# Altium project Using Signal Harnesses - Brendan Cook.PrjPCB
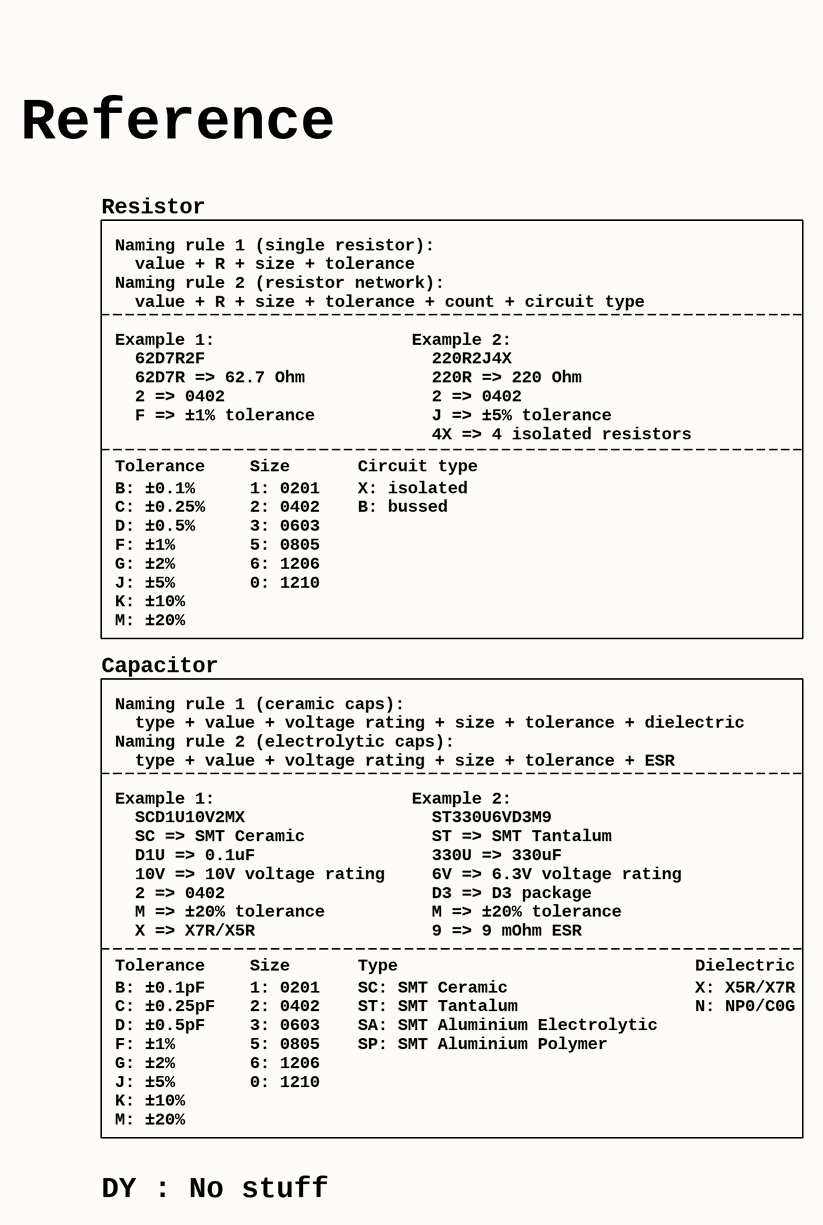
[diagram p0:  1_reference.SchDoc]
 Project: KAME_FMU;  ProjectRev: 2
9 sheets, 102 parts. Net scope: hierarchical (ports join the sheet entries above them; power ports are global).
Board file:  Kame_FMU.PcbDoc
Sheets:
   1_reference.SchDoc
   2_mb_conn.SchDoc
   3_power.SchDoc
   4_cpu.SchDoc
   5_spi_memory.SchDoc
   6_uart_esc_i2c.SchDoc
   7_can_rc_i2c_analog.SchDoc
   8_imu_debug_conn.SchDoc
   0_TOP_Sheet.SchDoc

## Sheet  1_reference.SchDoc: Reference
size A3; CompanyName: Altium; Organization: Altium Training Team; Address1: Canada/Germany; Address2: UK / USA and Partner; Address3: Adv Training; Address4: (c) Altium; SheetNumber: 1; SheetTotal: 9

### Notes on the sheet
- Reference
- Resistor
- Naming rule 1 (single resistor):
  value + R + size + tolerance
  Naming rule 2 (resistor network):
  value + R + size + tolerance + count + circuit type
- Example 1:
  62D7R2F
  62D7R => 62.7 Ohm
  2 => 0402
  F => ±1% tolerance
- Tolerance
- Size
- Circuit type
- Example 2:
  220R2J4X
  220R => 220 Ohm
  2 => 0402
  J => ±5% tolerance
  4X => 4 isolated resistors
- B: ±0.1%
  C: ±0.25%
  D: ±0.5%
  F: ±1%
  G: ±2%
  J: ±5%
  K: ±10%
  M: ±20%
- 1: 0201
  2: 0402
  3: 0603
  5: 0805
  6: 1206
  0: 1210
- X: isolated
  B: bussed
- Capacitor
- Naming rule 1 (ceramic caps):
  type + value + voltage rating + size + tolerance + dielectric
  Naming rule 2 (electrolytic caps):
  type + value + voltage rating + size + tolerance + ESR
- Example 1:
  SCD1U10V2MX
  SC => SMT Ceramic
  D1U => 0.1uF
  10V => 10V voltage rating
  2 => 0402
  M => ±20% tolerance
  X => X7R/X5R
- Example 2:
  ST330U6VD3M9
  ST => SMT Tantalum
  330U => 330uF
  6V => 6.3V voltage rating
  D3 => D3 package
  M => ±20% tolerance
  9 => 9 mOhm ESR
- Type
- Dielectric
- B: ±0.1pF
  C: ±0.25pF
  D: ±0.5pF
  F: ±1%
  G: ±2%
  J: ±5%
  K: ±10%
  M: ±20%
- SC: SMT Ceramic
  ST: SMT Tantalum
  SA: SMT Aluminium Electrolytic
  SP: SMT Aluminium Polymer
- X: X5R/X7R
  N: NP0/C0G
- DY : No stuff
- Title
- Size:
- Date:
- A3
- Number:
- Time:
- Revision:
- Sheet
- of
- File:

## Sheet  2_mb_conn.SchDoc: Motherboard connectors
size A3; CompanyName: Altium; Organization: Altium Training Team; Address1: Canada/Germany; Address2: UK / USA and Partner; Address3: Adv Training; Address4: (c) Altium; SheetNumber: 2; SheetTotal: 9
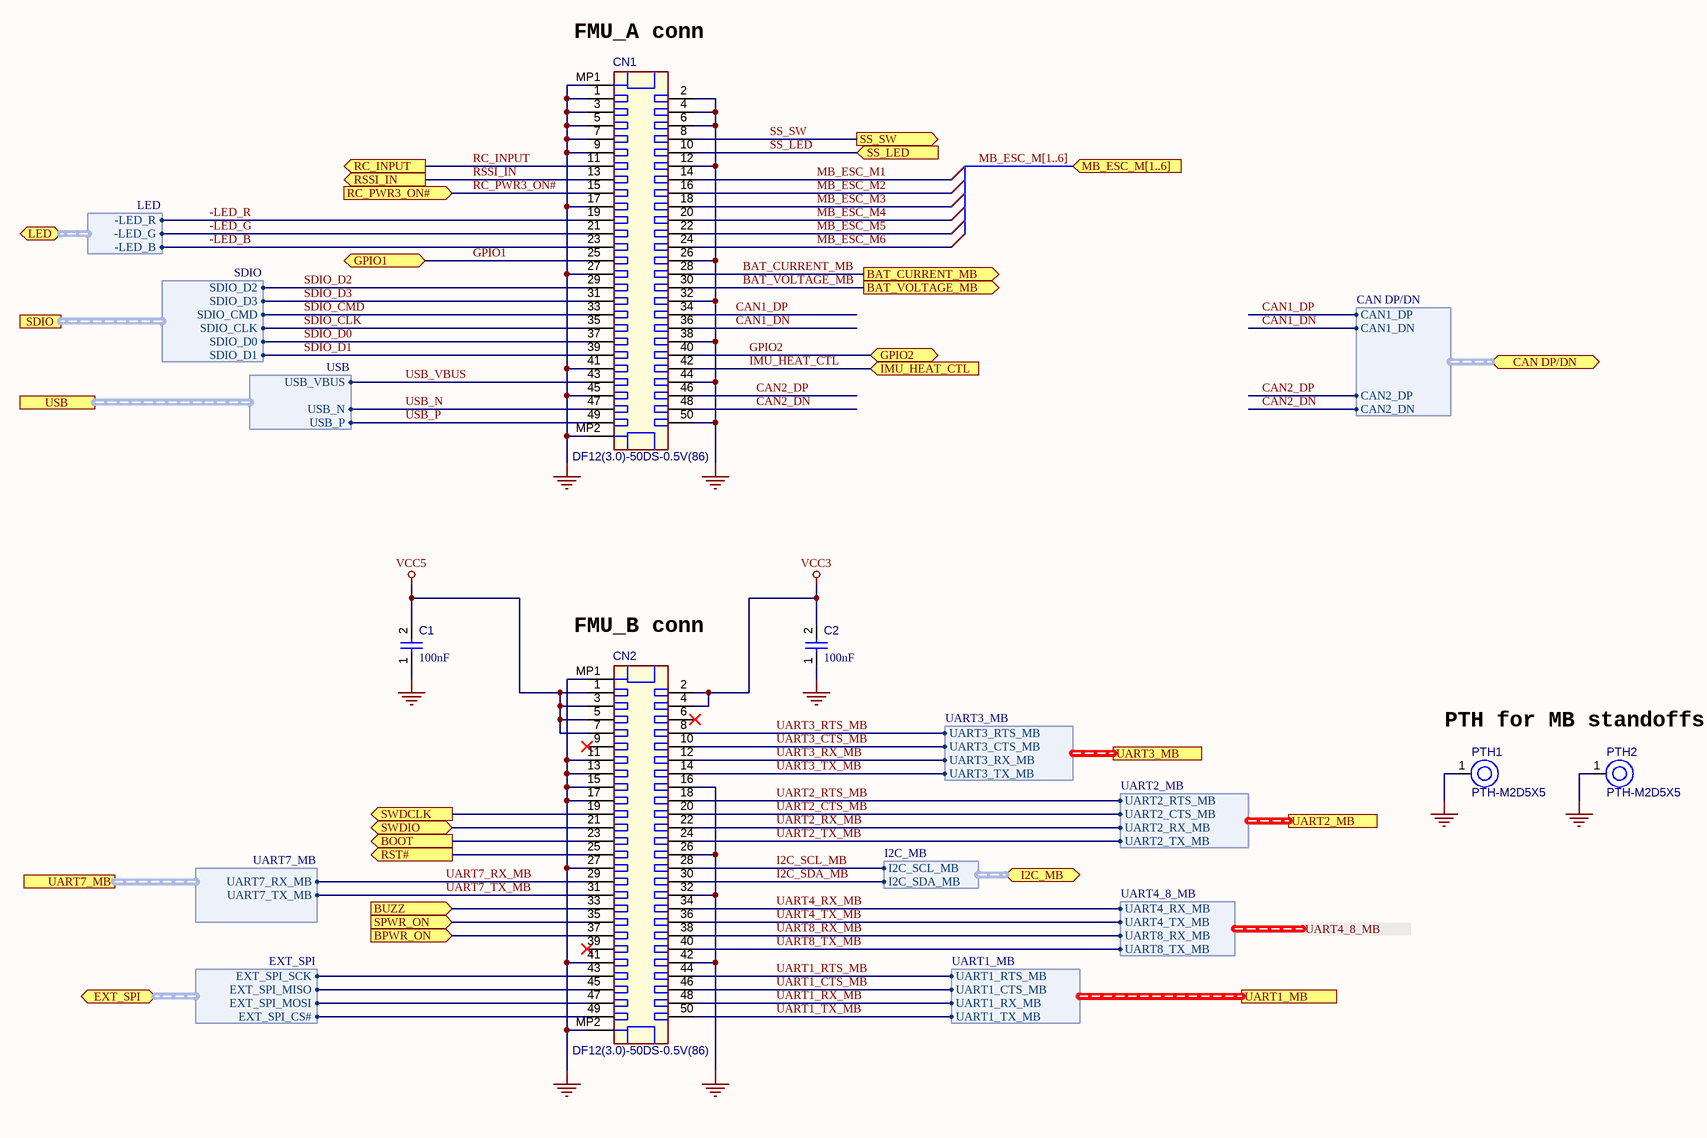
[diagram p1:  2_mb_conn.SchDoc]

### Parts
C1  value 100nF  [CAPC0402(1005)60_L]  (hidden comment: Capacitor 100nF +/-20% 10V 0402)
C2  value 100nF  [CAPC0402(1005)60_L]  (hidden comment: Capacitor 100nF +/-20% 10V 0402)
CN1  DF12(3.0)-50DS-0.5V(86)  [HIRO-DF12(3.0)-50DS-0.5V_V]
CN2  DF12(3.0)-50DS-0.5V(86)  [HIRO-DF12(3.0)-50DS-0.5V_V]
PTH1  PTH-M2D5X5  [PTH-M2D5X5]
PTH2  PTH-M2D5X5  [PTH-M2D5X5]

### Ports
BAT_CURRENT_MB (out), BAT_VOLTAGE_MB (out), BOOT (out), BPWR_ON (in), BUZZ (in), CAN DP/DN (bidir, harness CAN DP/DN), EXT_SPI (bidir, harness EXT_SPI), GPIO1 (bidir), GPIO2 (bidir), I2C_MB (bidir, harness I2C_MB), IMU_HEAT_CTL (in), LED (bidir, harness LED), MB_ESC_M[1..6] (in), RC_INPUT (out), RC_PWR3_ON# (in), RSSI_IN (out), RST# (out), SDIO (harness SDIO), SPWR_ON (in), SS_LED (in), SS_SW (out), SWDCLK (out), SWDIO (bidir), UART1_MB (harness UART1_MB), UART2_MB (harness UART2_MB), UART3_MB (harness UART3_MB), UART4_8_MB (harness UART4_8_MB), UART7_MB (harness UART7_MB), USB (harness USB)

### Harnesses
SDIO: SDIO_D2, SDIO_D3, SDIO_CMD, SDIO_CLK, SDIO_D0, SDIO_D1
USB: USB_VBUS, USB_N, USB_P
LED: -LED_R, -LED_G, -LED_B
CAN DP/DN: CAN1_DP, CAN1_DN, CAN2_DP, CAN2_DN
UART3_MB: UART3_RTS_MB, UART3_CTS_MB, UART3_RX_MB, UART3_TX_MB
UART2_MB: UART2_RTS_MB, UART2_CTS_MB, UART2_RX_MB, UART2_TX_MB
UART1_MB: UART1_RTS_MB, UART1_CTS_MB, UART1_RX_MB, UART1_TX_MB
I2C_MB: I2C_SCL_MB, I2C_SDA_MB
EXT_SPI: EXT_SPI_SCK, EXT_SPI_MISO, EXT_SPI_MOSI, EXT_SPI_CS#
UART4_8_MB: UART4_RX_MB, UART4_TX_MB, UART8_RX_MB, UART8_TX_MB
UART7_MB: UART7_RX_MB, UART7_TX_MB

### Nets
GND: C1.1 C2.1 CN1.1 CN1.2 CN1.3 CN1.4 CN1.5 CN1.6 CN1.7 CN1.9 CN1.12 CN1.17 CN1.26 CN1.27 CN1.32 CN1.38 CN1.41 CN1.44 CN1.45 CN1.50 CN1.MP1 CN1.MP2 CN2.11 CN2.13 CN2.15 CN2.16 CN2.17 CN2.26 CN2.27 CN2.32 CN2.41 CN2.42 CN2.MP1 CN2.MP2 PTH1.1(H1) PTH2.1(H1)
VCC3: C2.2 CN2.2 CN2.4
VCC5: C1.2 CN2.1 CN2.3 CN2.5 CN2.7
-LED_B: CN1.23 ; port LED.-LED_B
-LED_G: CN1.21 ; port LED.-LED_G
-LED_R: CN1.19 ; port LED.-LED_R
BAT_CURRENT_MB: CN1.28 ; port BAT_CURRENT_MB
BAT_VOLTAGE_MB: CN1.30 ; port BAT_VOLTAGE_MB
CAN1_DN: CN1.36 ; port CAN DP/DN.CAN1_DN
CAN1_DP: CN1.34 ; port CAN DP/DN.CAN1_DP
CAN2_DN: CN1.48 ; port CAN DP/DN.CAN2_DN
CAN2_DP: CN1.46 ; port CAN DP/DN.CAN2_DP
GPIO1: CN1.25 ; port GPIO1
GPIO2: CN1.40 ; port GPIO2
I2C_SCL_MB: CN2.28 ; port I2C_MB.I2C_SCL_MB
I2C_SDA_MB: CN2.30 ; port I2C_MB.I2C_SDA_MB
IMU_HEAT_CTL: CN1.42 ; port IMU_HEAT_CTL
MB_ESC_M1: CN1.14
MB_ESC_M2: CN1.16
MB_ESC_M3: CN1.18
MB_ESC_M4: CN1.20
MB_ESC_M5: CN1.22
MB_ESC_M6: CN1.24
RC_INPUT: CN1.11 ; port RC_INPUT
RC_PWR3_ON#: CN1.15 ; port RC_PWR3_ON#
RSSI_IN: CN1.13 ; port RSSI_IN
SDIO_CLK: CN1.35 ; port SDIO.SDIO_CLK
SDIO_CMD: CN1.33 ; port SDIO.SDIO_CMD
SDIO_D0: CN1.37 ; port SDIO.SDIO_D0
SDIO_D1: CN1.39 ; port SDIO.SDIO_D1
SDIO_D2: CN1.29 ; port SDIO.SDIO_D2
SDIO_D3: CN1.31 ; port SDIO.SDIO_D3
SS_LED: CN1.10 ; port SS_LED
SS_SW: CN1.8 ; port SS_SW
UART1_CTS_MB: CN2.46 ; port UART1_MB.UART1_CTS_MB
UART1_RTS_MB: CN2.44 ; port UART1_MB.UART1_RTS_MB
UART1_RX_MB: CN2.48 ; port UART1_MB.UART1_RX_MB
UART1_TX_MB: CN2.50 ; port UART1_MB.UART1_TX_MB
UART2_CTS_MB: CN2.20 ; port UART2_MB.UART2_CTS_MB
UART2_RTS_MB: CN2.18 ; port UART2_MB.UART2_RTS_MB
UART2_RX_MB: CN2.22 ; port UART2_MB.UART2_RX_MB
UART2_TX_MB: CN2.24 ; port UART2_MB.UART2_TX_MB
UART3_CTS_MB: CN2.10 ; port UART3_MB.UART3_CTS_MB
UART3_RTS_MB: CN2.8 ; port UART3_MB.UART3_RTS_MB
UART3_RX_MB: CN2.12 ; port UART3_MB.UART3_RX_MB
UART3_TX_MB: CN2.14 ; port UART3_MB.UART3_TX_MB
UART4_RX_MB: CN2.34 ; port UART4_8_MB.UART4_RX_MB
UART4_TX_MB: CN2.36 ; port UART4_8_MB.UART4_TX_MB
UART7_RX_MB: CN2.29 ; port UART7_MB.UART7_RX_MB
UART7_TX_MB: CN2.31 ; port UART7_MB.UART7_TX_MB
UART8_RX_MB: CN2.38 ; port UART4_8_MB.UART8_RX_MB
UART8_TX_MB: CN2.40 ; port UART4_8_MB.UART8_TX_MB
USB_N: CN1.47 ; port USB.USB_N
USB_P: CN1.49 ; port USB.USB_P
USB_VBUS: CN1.43 ; port USB.USB_VBUS
NetCN2_19: CN2.19 ; port SWDCLK
NetCN2_21: CN2.21 ; port SWDIO
NetCN2_23: CN2.23 ; port BOOT
NetCN2_25: CN2.25 ; port RST#
NetCN2_33: CN2.33 ; port BUZZ
NetCN2_35: CN2.35 ; port SPWR_ON
NetCN2_37: CN2.37 ; port BPWR_ON
NetCN2_43: CN2.43 ; port EXT_SPI.EXT_SPI_SCK
NetCN2_45: CN2.45 ; port EXT_SPI.EXT_SPI_MISO
NetCN2_47: CN2.47 ; port EXT_SPI.EXT_SPI_MOSI
NetCN2_49: CN2.49 ; port EXT_SPI.EXT_SPI_CS#

Not connected (* = marked no-connect by the designer): CN2 6* 9* 39*

### Buses and harness runs
bus MB_ESC_M[1..6] = port MB_ESC_M[1..6]

### Notes on the sheet
- (near CN1) FMU_A conn
- (near CN2) FMU_B conn
- PTH for MB standoffs
- Title
- Size:
- Date:
- A3
- Number:
- Time:
- Revision:
- Sheet
- of
- File:

### Library data of the parts
C1 C2 = CMP-001-00061-2: Chip Capacitor, 100nF +/-20%, 10V, 0402, Thickness 0.6 mm; Tolerance: 20%; Voltage Rating: 10V; Mounting Technology: SMT; Min Operating Temperature: -55°C; Pins: 2; Case/Package: 0402; Max Operating Temperature: 85°C
CN1 CN2 = CMP-002-00058-3: Receptacle Connector, 50 V, 0.3 A, -45 to 125 degC, RoHS, Tape and Reel; Pins: 52
PTH1 PTH2 = CMP-00028-00004-1: M2 PTH (2.5mm), 5mm pad; Pins: 1

## Sheet  3_power.SchDoc
size A4; CompanyName: Altium; Organization: Altium Training Team; Address1: Canada/Germany; Address2: UK / USA and Partner; Address3: Adv Training; Address4: (c) Altium; SheetNumber: 3; SheetTotal: 9
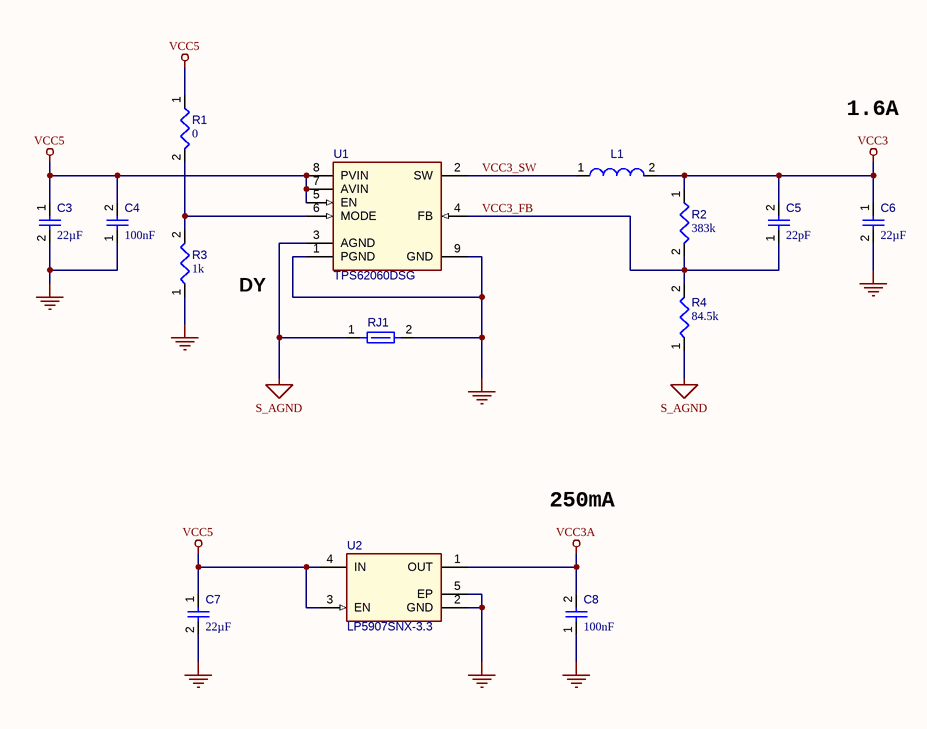
[diagram p2:  3_power.SchDoc]

### Parts
C3  value 22µF  [CAPC0805(2012)145_L]  (hidden comment: Capacitor 22µF +/-40% 16V 0805)
C4  value 100nF  [CAPC0402(1005)60_L]  (hidden comment: Capacitor 100nF +/-20% 10V 0402)
C5  value 22pF  [CAPC0402(1005)60_L]  (hidden comment: Capacitor 22pF +/-10% 50V 0402)
C6  value 22µF  [CAPC0805(2012)145_L]  (hidden comment: Capacitor 22µF +/-40% 16V 0805)
C7  value 22µF  [CAPC0805(2012)145_L]  (hidden comment: Capacitor 22µF +/-40% 16V 0805)
C8  value 100nF  [CAPC0402(1005)60_L]  (hidden comment: Capacitor 100nF +/-20% 10V 0402)
L1  VLS252010HBX-2R2M-1  [TDK-VLS252010_V]  (value not drawn)
R1  value 0  [RESC0402(1005)_L]  (hidden comment: Jumper 0402)
R2  value 383k  [RESC0402(1005)_L]  (hidden comment: Resistor 383K +/-1 % 0402 63 mW)
R3  value 1k  [RESC0402(1005)_L]  (hidden comment: Resistor 1K +/-5 % 0402 63 mW)
R4  value 84.5k  [RESC0402(1005)_L]  (hidden comment: Resistor 84K5 +/-1 % 0402 63 mW)
RJ1  Net Tie 10x8mil  [New footprint 1]  (value not drawn)  (net tie, no BOM)
U1  TPS62060DSG  [DSG0008A_V]
U2  LP5907SNX-3.3  [TI-DQN4-480X480TP_V]

### Nets
GND: C3.2 C4.1 C6.2 C7.2 C8.1 R3.1 RJ1.2 U1.1(PGND) U1.9(GND) U2.2(GND) U2.5(EP)
S_AGND: R4.1 RJ1.1 U1.3(AGND)
VCC3: C5.2 C6.1 L1.2 R2.1
VCC3A: C8.2 U2.1(OUT)
VCC5: C3.1 C4.2 C7.1 R1.1 U1.5(EN) U1.7(AVIN) U1.8(PVIN) U2.3(EN) U2.4(IN)
VCC3_FB: C5.1 R2.2 R4.2 U1.4(FB)
VCC3_SW: L1.1 U1.2(SW)
NetR1_2: R1.2 R3.2 U1.6(MODE)

### Notes on the sheet
- 1.6A
- DY
- 250mA
- Title
- Size:
- Date:
- A4
- Number:
- Time:
- Revision:
- Sheet
- of
- File:

### Library data of the parts
C3 C6 C7 = CMP-001-00081-3: Chip Capacitor, 22µF +/-40%, 16V, 0805, Thickness 1.45 mm; Tolerance: 5%; Voltage Rating: 16V; Case/Package: 0805; Pins: 2; Mounting Technology: SMT; Max Operating Temperature: 85°C; Min Operating Temperature: -55°C
C4 C8 = CMP-001-00061-2: as C1 on sheet  2_mb_conn; Case/Package: 0402; Min Operating Temperature: -55°C; Mounting Technology: SMT; Max Operating Temperature: 85°C; Pins: 2; Voltage Rating: 10V
C5 = CMP-001-00073-2: Chip Capacitor, 22pF +/-10%, 50V, 0402, Thickness 0.6 mm; Tolerance: 10%; Mounting Technology: SMT; Pins: 2; Voltage Rating: 50V; Case/Package: 0402; Max Operating Temperature: 85°C; Min Operating Temperature: -55°C
L1 = CMP-006-00020-3: Inductor for Power Circuit, 2.2 uH, +/- 20%, -40 to 105 degC, 2-Pin SMD, RoHS, Tape and Reel; Value: 2.2µH; Tolerance: 20%; Mounting Technology: SurfaceMount; Pins: 2
R1 = CMP-009-00148-2: Case/Package: 0402; Max Operating Temperature: 155°C; Min Operating Temperature: -55°C; Pins: 2
R2 = CMP-009-00126-2: Chip Resistor, 383 kOhms, +/-1 %, 63 mW, -55 to 155 degC, 0402; Tolerance: 1%; Power: 63mW; Case/Package: 0402; Max Operating Temperature: 155°C; Min Operating Temperature: -55°C; Pins: 2
R3 = CMP-009-00157-2: Chip Resistor, 1 kOhms, +/-5 %, 63 mW, -55 to 155 degC, 0402; Tolerance: 5%; Power: 63mW; Case/Package: 0402; Max Operating Temperature: 155°C; Min Operating Temperature: -55°C; Pins: 2
R4 = CMP-009-00130-2: Chip Resistor, 84,5 kOhms, +/-1 %, 63 mW, -55 to 155 degC, 0402; Tolerance: 1%; Power: 63mW; Case/Package: 0402; Max Operating Temperature: 155°C; Min Operating Temperature: -55°C; Pins: 2
RJ1 = CMP-009-00116-1: Pins: 2; Max Operating Temperature: 155°C; Min Operating Temperature: -55°C
U1 = CMP-019-00038-2: Step Down Converter, 3 MHz, 1.6 A, -45 to 85 degC, 8-Pin WSON, RoHS, Tape and Reel; Pins: 9
U2 = CMP-019-00040-2: Ultra-Low-Noise, Low-IQ LDO, 3.3 V, 0.25 A, -40 to 125 degC, 4-Pin X2SON, RoHS, Tape and Reel; Output Voltage: 3.3V; Min Operating Temperature: -40°C; Pins: 5; Max Operating Temperature: 125°C

## Sheet  4_cpu.SchDoc: CPU (STM32F427VIT6)
size A2; CompanyName: Altium; Organization: Altium Training Team; Address1: Canada/Germany; Address2: UK / USA and Partner; Address3: Adv Training; Address4: (c) Altium; SheetNumber: 4; SheetTotal: 9
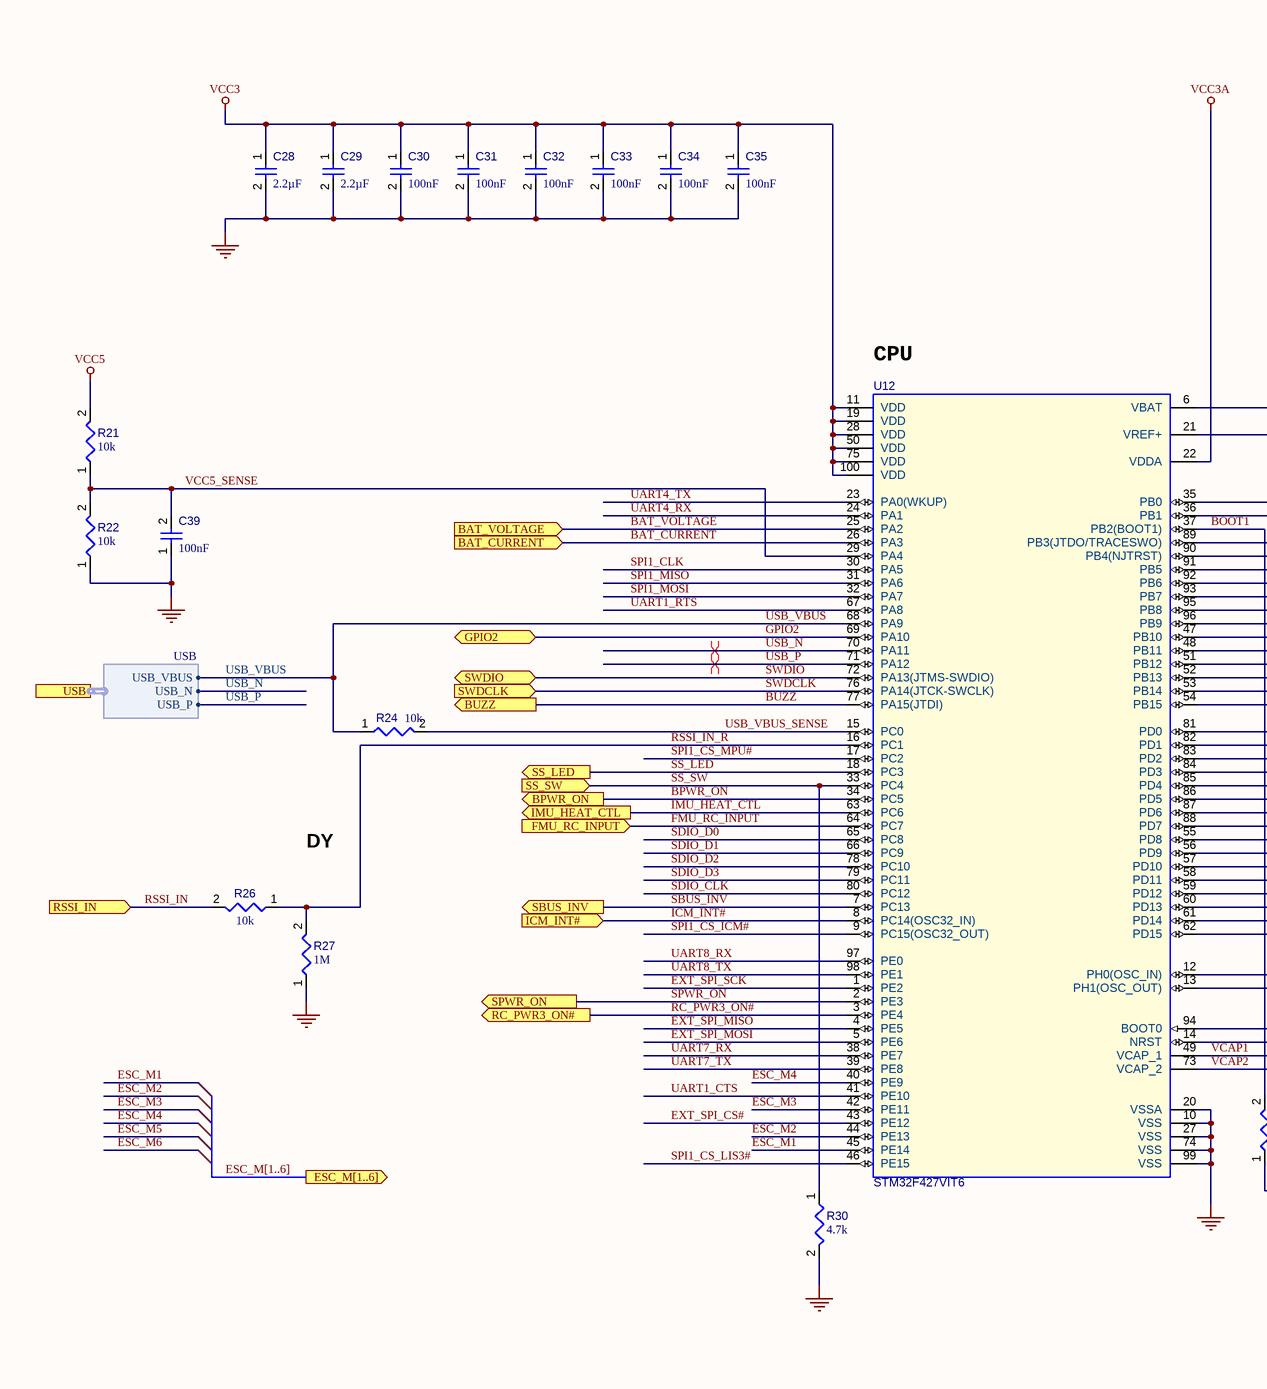
[diagram p3:  4_cpu.SchDoc, left]
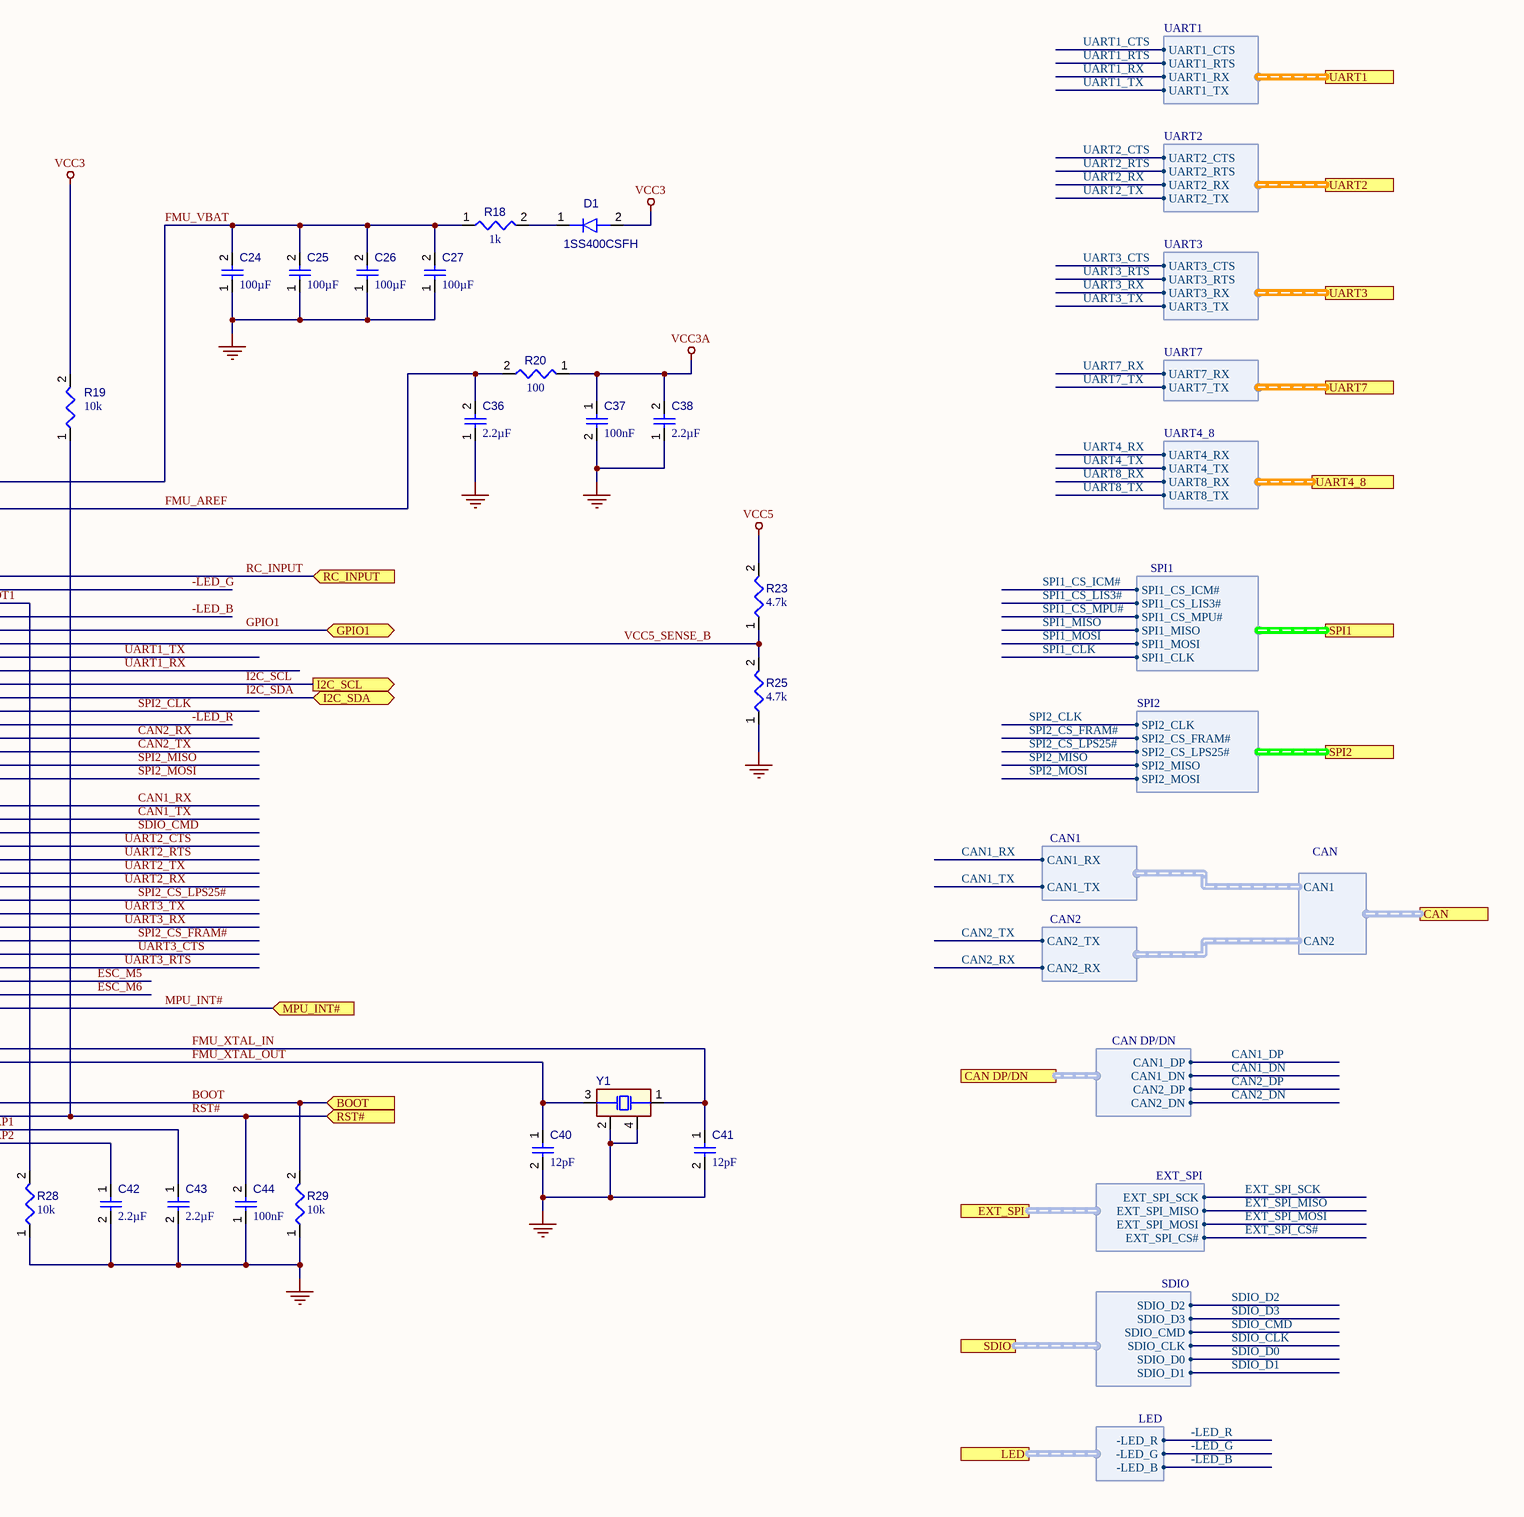
[diagram p4:  4_cpu.SchDoc, right]

### Parts
C24  value 100µF  [CAPC0805(2012)145_L]  (hidden comment: Capacitor 100µF +/-20% 6.3V 0805)
C25  value 100µF  [CAPC0805(2012)145_L]  (hidden comment: Capacitor 100µF +/-20% 6.3V 0805)
C26  value 100µF  [CAPC0805(2012)145_L]  (hidden comment: Capacitor 100µF +/-20% 6.3V 0805)
C27  value 100µF  [CAPC0805(2012)145_L]  (hidden comment: Capacitor 100µF +/-20% 6.3V 0805)
C28  value 2.2µF  [CAPC0402(1005)60_L]  (hidden comment: Capacitor 2,2µF +/-20% 10V 0402)
C29  value 2.2µF  [CAPC0402(1005)60_L]  (hidden comment: Capacitor 2,2µF +/-20% 10V 0402)
C30  value 100nF  [CAPC0402(1005)60_L]  (hidden comment: Capacitor 100nF +/-20% 10V 0402)
C31  value 100nF  [CAPC0402(1005)60_L]  (hidden comment: Capacitor 100nF +/-20% 10V 0402)
C32  value 100nF  [CAPC0402(1005)60_L]  (hidden comment: Capacitor 100nF +/-20% 10V 0402)
C33  value 100nF  [CAPC0402(1005)60_L]  (hidden comment: Capacitor 100nF +/-20% 10V 0402)
C34  value 100nF  [CAPC0402(1005)60_L]  (hidden comment: Capacitor 100nF +/-20% 10V 0402)
C35  value 100nF  [CAPC0402(1005)60_L]  (hidden comment: Capacitor 100nF +/-20% 10V 0402)
C36  value 2.2µF  [CAPC0402(1005)60_L]  (hidden comment: Capacitor 2,2µF +/-20% 10V 0402)
C37  value 100nF  [CAPC0402(1005)60_L]  (hidden comment: Capacitor 100nF +/-20% 10V 0402)
C38  value 2.2µF  [CAPC0402(1005)60_L]  (hidden comment: Capacitor 2,2µF +/-20% 10V 0402)
C39  value 100nF  [CAPC0402(1005)60_L]  (hidden comment: Capacitor 100nF +/-20% 10V 0402)
C40  value 12pF  [CAPC0402(1005)33_L]  (hidden comment: Capacitor 12pF +/-10% 50V 0402)
C41  value 12pF  [CAPC0402(1005)33_L]  (hidden comment: Capacitor 12pF +/-10% 50V 0402)
C42  value 2.2µF  [CAPC0402(1005)60_L]  (hidden comment: Capacitor 2,2µF +/-20% 10V 0402)
C43  value 2.2µF  [CAPC0402(1005)60_L]  (hidden comment: Capacitor 2,2µF +/-20% 10V 0402)
C44  value 100nF  [CAPC0402(1005)60_L]  (hidden comment: Capacitor 100nF +/-20% 10V 0402)
D1  1SS400CSFH  [ROHM-VMN2-2_V]
R18  value 1k  [RESC0402(1005)_L]  (hidden comment: Resistor 1K +/-5 % 0402 63 mW)
R19  value 10k  [RESC0402(1005)_L]  (hidden comment: Resistor 10K  +/-1 % 0402 63 mW)
R20  value 100  [RESC0402(1005)_L]  (hidden comment: Resistor 100R +/-1 % 0402 63 mW)
R21  value 10k  [RESC0402(1005)_L]  (hidden comment: Resistor 10K  +/-1 % 0402 63 mW)
R22  value 10k  [RESC0402(1005)_L]  (hidden comment: Resistor 10K  +/-1 % 0402 63 mW)
R23  value 4.7k  [RESC0402(1005)_L]  (hidden comment: Resistor 4K7  +/-1 % 0402 63 mW)
R24  value 10k  [RESC0402(1005)_L]  (hidden comment: Resistor 10K  +/-1 % 0402 63 mW)
R25  value 4.7k  [RESC0402(1005)_L]  (hidden comment: Resistor 4K7  +/-1 % 0402 63 mW)
R26  value 10k  [RESC0402(1005)_L]  (hidden comment: Resistor 10K  +/-1 % 0402 63 mW)
R27  value 1M  [RESC0402(1005)_L]  (hidden comment: Resistor 1M +/-5 % 0402 63 mW)
R28  value 10k  [RESC0402(1005)_L]  (hidden comment: Resistor 10K  +/-1 % 0402 63 mW)
R29  value 10k  [RESC0402(1005)_L]  (hidden comment: Resistor 10K  +/-1 % 0402 63 mW)
R30  value 4.7k  [RESC0402(1005)_L]  (hidden comment: Resistor 4K7  +/-1 % 0402 63 mW)
U12  STM32F427VIT6  [STM-LQFP100]
Y1  FA-12824.0000MF10Z-W3  [EPSON-FA-128_V]  (value not drawn)

### Ports
BAT_CURRENT (in), BAT_VOLTAGE (in), BOOT (in), BPWR_ON (out), BUZZ (out), CAN (harness CAN), CAN DP/DN (harness CAN DP/DN), ESC_M[1..6] (out), EXT_SPI (harness EXT_SPI), FMU_RC_INPUT (in), GPIO1 (bidir), GPIO2 (bidir), I2C_SCL (out), I2C_SDA (bidir), ICM_INT# (in), IMU_HEAT_CTL (out), LED (harness LED), MPU_INT# (in), RC_INPUT (in), RC_PWR3_ON# (out), RSSI_IN (in), RST# (in), SBUS_INV (out), SDIO (harness SDIO), SPI1 (harness SPI1), SPI2 (harness SPI2), SPWR_ON (out), SS_LED (out), SS_SW (in), SWDCLK (in), SWDIO (bidir), UART1 (harness UART1), UART2 (harness UART2), UART3 (harness UART3), UART4_8 (harness UART4_8), UART7 (harness UART7), USB (harness USB)

### Harnesses
LED: -LED_R, -LED_G, -LED_B
CAN DP/DN: CAN1_DP, CAN1_DN, CAN2_DP, CAN2_DN
SDIO: SDIO_D2, SDIO_D3, SDIO_CMD, SDIO_CLK, SDIO_D0, SDIO_D1
USB: USB_VBUS, USB_N, USB_P
EXT_SPI: EXT_SPI_SCK, EXT_SPI_MISO, EXT_SPI_MOSI, EXT_SPI_CS#
UART4_8: UART4_RX, UART4_TX, UART8_RX, UART8_TX
UART1: UART1_CTS, UART1_RTS, UART1_RX, UART1_TX
UART2: UART2_CTS, UART2_RTS, UART2_RX, UART2_TX
UART3: UART3_CTS, UART3_RTS, UART3_RX, UART3_TX
UART7: UART7_RX, UART7_TX
SPI1: SPI1_CS_ICM#, SPI1_CS_LIS3#, SPI1_CS_MPU#, SPI1_MISO, SPI1_MOSI, SPI1_CLK
SPI2: SPI2_CLK, SPI2_CS_FRAM#, SPI2_CS_LPS25#, SPI2_MISO, SPI2_MOSI
CAN: CAN1, CAN2
CAN1: CAN1_RX, CAN1_TX
CAN2: CAN2_RX, CAN2_TX

### Nets
GND: C24.1 C25.1 C26.1 C27.1 C28.2 C29.2 C30.2 C31.2 C32.2 C33.2 C34.2 C35.2 C36.1 C37.2 C38.1 C39.1 C40.2 C41.2 C42.2 C43.2 C44.1 R22.1 R25.1 R27.1 R28.1 R29.1 R30.2 U12.10(VSS) U12.20(VSSA) U12.27(VSS) U12.74(VSS) U12.99(VSS) Y1.2(NC) Y1.4(NC)
VCC3: C28.1 C29.1 C30.1 C31.1 C32.1 C33.1 C34.1 C35.1 D1.2(A) R19.2 U12.11(VDD) U12.19(VDD) U12.28(VDD) U12.50(VDD) U12.75(VDD) U12.100(VDD)
VCC3A: C37.1 C38.2 R20.1 U12.22(VDDA)
VCC5: R21.2 R23.2
-LED_B: U12.89(PB3(JTDO/TRACESWO)) ; port LED.-LED_B
-LED_G: U12.36(PB1) ; port LED.-LED_G
-LED_R: U12.48(PB11) ; port LED.-LED_R
BAT_CURRENT: U12.26(PA3) ; port BAT_CURRENT
BAT_VOLTAGE: U12.25(PA2) ; port BAT_VOLTAGE
BOOT: R29.2 U12.94(BOOT0) ; port BOOT
BOOT1: R28.2 U12.37(PB2(BOOT1))
BPWR_ON: U12.34(PC5) ; port BPWR_ON
BUZZ: U12.77(PA15(JTDI)) ; port BUZZ
CAN1_DN: port CAN DP/DN.CAN1_DN
CAN1_DP: port CAN DP/DN.CAN1_DP
CAN1_RX: U12.81(PD0) ; harness CAN1.CAN1_RX
CAN1_TX: U12.82(PD1) ; harness CAN1.CAN1_TX
CAN2_DN: port CAN DP/DN.CAN2_DN
CAN2_DP: port CAN DP/DN.CAN2_DP
CAN2_RX: U12.51(PB12) ; harness CAN2.CAN2_RX
CAN2_TX: U12.52(PB13) ; harness CAN2.CAN2_TX
ESC_M1: U12.45(PE14)
ESC_M2: U12.44(PE13)
ESC_M3: U12.42(PE11)
ESC_M4: U12.40(PE9)
ESC_M5: U12.60(PD13)
ESC_M6: U12.61(PD14)
EXT_SPI_CS#: U12.43(PE12) ; port EXT_SPI.EXT_SPI_CS#
EXT_SPI_MISO: U12.4(PE5) ; port EXT_SPI.EXT_SPI_MISO
EXT_SPI_MOSI: U12.5(PE6) ; port EXT_SPI.EXT_SPI_MOSI
EXT_SPI_SCK: U12.1(PE2) ; port EXT_SPI.EXT_SPI_SCK
FMU_AREF: C36.2 R20.2 U12.21(VREF+)
FMU_RC_INPUT: U12.64(PC7) ; port FMU_RC_INPUT
FMU_VBAT: C24.2 C25.2 C26.2 C27.2 R18.1 U12.6(VBAT)
FMU_XTAL_IN: C41.1 U12.12(PH0(OSC_IN)) Y1.1(X1)
FMU_XTAL_OUT: C40.1 U12.13(PH1(OSC_OUT)) Y1.3(X2)
GPIO1: U12.90(PB4(NJTRST)) ; port GPIO1
GPIO2: U12.69(PA10) ; port GPIO2
I2C_SCL: U12.95(PB8) ; port I2C_SCL
I2C_SDA: U12.96(PB9) ; port I2C_SDA
ICM_INT#: U12.8(PC14(OSC32_IN)) ; port ICM_INT#
IMU_HEAT_CTL: U12.63(PC6) ; port IMU_HEAT_CTL
MPU_INT#: U12.62(PD15) ; port MPU_INT#
RC_INPUT: U12.35(PB0) ; port RC_INPUT
RC_PWR3_ON#: U12.3(PE4) ; port RC_PWR3_ON#
RSSI_IN: R26.2 ; port RSSI_IN
RSSI_IN_R: R26.1 R27.2 U12.16(PC1)
RST#: C44.2 R19.1 U12.14(NRST) ; port RST#
SBUS_INV: U12.7(PC13) ; port SBUS_INV
SDIO_CLK: U12.80(PC12) ; port SDIO.SDIO_CLK
SDIO_CMD: U12.83(PD2) ; port SDIO.SDIO_CMD
SDIO_D0: U12.65(PC8) ; port SDIO.SDIO_D0
SDIO_D1: U12.66(PC9) ; port SDIO.SDIO_D1
SDIO_D2: U12.78(PC10) ; port SDIO.SDIO_D2
SDIO_D3: U12.79(PC11) ; port SDIO.SDIO_D3
SPI1_CLK: U12.30(PA5) ; port SPI1.SPI1_CLK
SPI1_CS_ICM#: U12.9(PC15(OSC32_OUT)) ; port SPI1.SPI1_CS_ICM#
SPI1_CS_LIS3#: U12.46(PE15) ; port SPI1.SPI1_CS_LIS3#
SPI1_CS_MPU#: U12.17(PC2) ; port SPI1.SPI1_CS_MPU#
SPI1_MISO: U12.31(PA6) ; port SPI1.SPI1_MISO
SPI1_MOSI: U12.32(PA7) ; port SPI1.SPI1_MOSI
SPI2_CLK: U12.47(PB10) ; port SPI2.SPI2_CLK
SPI2_CS_FRAM#: U12.57(PD10) ; port SPI2.SPI2_CS_FRAM#
SPI2_CS_LPS25#: U12.88(PD7) ; port SPI2.SPI2_CS_LPS25#
SPI2_MISO: U12.53(PB14) ; port SPI2.SPI2_MISO
SPI2_MOSI: U12.54(PB15) ; port SPI2.SPI2_MOSI
SPWR_ON: U12.2(PE3) ; port SPWR_ON
SS_LED: U12.18(PC3) ; port SS_LED
SS_SW: R30.1 U12.33(PC4) ; port SS_SW
SWDCLK: U12.76(PA14(JTCK-SWCLK)) ; port SWDCLK
SWDIO: U12.72(PA13(JTMS-SWDIO)) ; port SWDIO
UART1_CTS: U12.41(PE10) ; port UART1.UART1_CTS
UART1_RTS: U12.67(PA8) ; port UART1.UART1_RTS
UART1_RX: U12.93(PB7) ; port UART1.UART1_RX
UART1_TX: U12.92(PB6) ; port UART1.UART1_TX
UART2_CTS: U12.84(PD3) ; port UART2.UART2_CTS
UART2_RTS: U12.85(PD4) ; port UART2.UART2_RTS
UART2_RX: U12.87(PD6) ; port UART2.UART2_RX
UART2_TX: U12.86(PD5) ; port UART2.UART2_TX
UART3_CTS: U12.58(PD11) ; port UART3.UART3_CTS
UART3_RTS: U12.59(PD12) ; port UART3.UART3_RTS
UART3_RX: U12.56(PD9) ; port UART3.UART3_RX
UART3_TX: U12.55(PD8) ; port UART3.UART3_TX
UART4_RX: U12.24(PA1) ; port UART4_8.UART4_RX
UART4_TX: U12.23(PA0(WKUP)) ; port UART4_8.UART4_TX
UART7_RX: U12.38(PE7) ; port UART7.UART7_RX
UART7_TX: U12.39(PE8) ; port UART7.UART7_TX
UART8_RX: U12.97(PE0) ; port UART4_8.UART8_RX
UART8_TX: U12.98(PE1) ; port UART4_8.UART8_TX
USB_N: U12.70(PA11) ; port USB.USB_N
USB_P: U12.71(PA12) ; port USB.USB_P
USB_VBUS: R24.1 U12.68(PA9) ; port USB.USB_VBUS
USB_VBUS_SENSE: R24.2 U12.15(PC0)
VCAP1: C43.1 U12.49(VCAP_1)
VCAP2: C42.1 U12.73(VCAP_2)
VCC5_SENSE: C39.2 R21.1 R22.2 U12.29(PA4)
VCC5_SENSE_B: R23.1 R25.2 U12.91(PB5)
NetD1_1: D1.1(K) R18.2

### Buses and harness runs
bus ESC_M[1..6] = port ESC_M[1..6]

### Layout directives
differential pair; rule Differential Pairs Routing [Pref Gap = 0.15mm    Min Gap  = 0.1mm    Max Gap  = 0.254mmPref Width = 0.15mm    Min Width  = 0.1mm    Max Width  = 0.381mm]: USB_N
differential pair; rule Differential Pairs Routing [Pref Gap = 0.15mm    Min Gap  = 0.1mm    Max Gap  = 0.254mmPref Width = 0.1mm    Min Width  = 0.1mm    Max Width  = 0.381mm]: USB_P

### Notes on the sheet
- (near U12) CPU
- DY
- Title
- Size:
- Date:
- File:
- A2
- Number:
- Time:
- Revision:
- Sheet
- of

### Library data of the parts
C24-C27 = CMP-001-00054-3: Chip Capacitor, 100µF +/-20%, 6.3V, 0805, Thickness 1.45 mm; Tolerance: 10%; Max Operating Temperature: 85°C; Mounting Technology: SMT; Case/Package: 0805; Voltage Rating: 6.3V; Min Operating Temperature: -55°C; Pins: 2
C28 C29 C36 C38 C42 C43 = CMP-001-00056-3: Chip Capacitor, 2,2µF +/-20%, 10V, 0402, Thickness 0.6 mm; Tolerance: 10%; Case/Package: 0402; Voltage Rating: 10V; Pins: 2; Mounting Technology: SMT; Max Operating Temperature: 85°C; Min Operating Temperature: -55°C
C30-C35 C37 C39 C44 = CMP-001-00061-2: as C1 on sheet  2_mb_conn; Case/Package: 0402; Min Operating Temperature: -55°C; Mounting Technology: SMT; Max Operating Temperature: 85°C; Pins: 2; Voltage Rating: 10V
C40 C41 = CMP-001-00072-3: Chip Capacitor, 12pF +/-10%, 50V, 0402, Thickness 0.33 mm; Tolerance: 20%; Case/Package: 0402; Mounting Technology: SMT; Pins: 2; Voltage Rating: 50V; Max Operating Temperature: 85°C; Min Operating Temperature: -55°C
D1 = CMP-004-00022-2: Switching Diode (High Speed Switching), 80 V, 100 mA, 2-Pin SOD-923, RoHS, Tape and Reel; Mounting Technology: SMT; Pins: 2
R18 = CMP-009-00157-2: as R3 on sheet  3_power; Case/Package: 0402; Max Operating Temperature: 155°C; Min Operating Temperature: -55°C; Pins: 2
R19 R21 R22 R24 R26 R28 R29 = CMP-009-00149-2: Chip Resistor, 10 kOhms, +/-1 %, 63 mW, -55 to 125 degC, 0402; Tolerance: 1%; Power: 63mW; Case/Package: 0402; Max Operating Temperature: 155°C; Min Operating Temperature: -55°C; Pins: 2
R20 = CMP-009-00167-2: Chip Resistor, 100 Ohms, +/-1 %, 63 mW, -55 to 155 degC, 0402; Tolerance: 1%; Power: 63mW; Case/Package: 0402; Max Operating Temperature: 155°C; Min Operating Temperature: -55°C; Pins: 2
R23 R25 R30 = CMP-009-00158-2: Chip Resistor, 4,7 kOhms, +/-1 %, 63 mW, -55 to 155 degC, 0402; Tolerance: 1%; Power: 63mW; Case/Package: 0402; Max Operating Temperature: 155°C; Min Operating Temperature: -55°C; Pins: 2
R27 = CMP-009-00151-2: Chip Resistor, 1 MOhms, +/-5 %, 63 mW, -55 to 155 degC, 0402; Tolerance: 5%; Power: 63mW; Case/Package: 0402; Max Operating Temperature: 155°C; Min Operating Temperature: -55°C; Pins: 2
U12 = CMP-020-00021-2: ARM Cortex-M4 32-bit MCU+FPU, 2048 KB Flash, 256 KB Internal RAM, 82 I/Os, 100-Pin LQFP, -40 to 85 degC, Tape and Reel; Min Supply Voltage: 1.7V; RAM Size: 256; ComponentLink2URL: http://www.st.com/st-web-ui/static/active/en/resource/technical/document/datasheet/DM00071990.pdf; ComponentLink2Description: Datasheet; ComponentLink1Description: Manufacturer URL; Pins: 100; Mounting Technology: Surface Mount; ComponentLink1URL: http://www.st.com/
Y1 = CMP-003-00028-1: Crystal, 24 MHz, +/- 10 ppm, -20 to 75 degC, 4-Pin SMD, RoHS, Tape and Reel; ESR: 80; Load Capacitance: 12pF; Frequency: 24MHz; Mounting Technology: SMT; Pins: 4; RoHS Compliant: Yes; Max Operating Temperature: 75°C; Case/Package: SMD/SMT; Min Operating Temperature: -20°C

## Sheet  5_spi_memory.SchDoc: SPI memory (FM25V02A)
size A4; CompanyName: Altium; Organization: Altium Training Team; Address1: Canada/Germany; Address2: UK / USA and Partner; Address3: Adv Training; Address4: (c) Altium; SheetNumber: 5; SheetTotal: 9
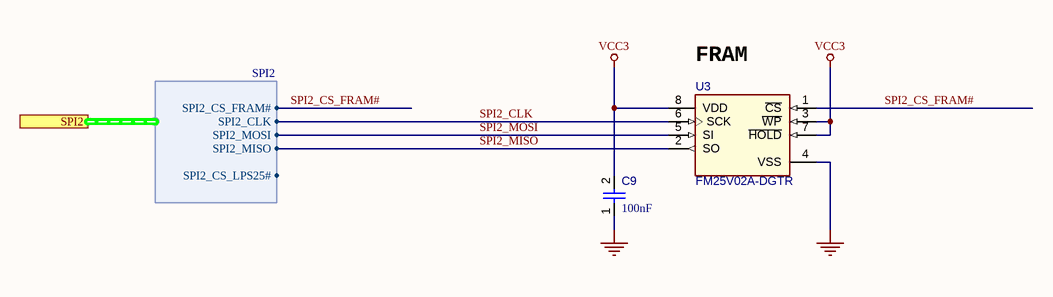
[diagram p5:  5_spi_memory.SchDoc]

### Parts
C9  value 100nF  [CAPC0402(1005)60_L]  (hidden comment: Capacitor 100nF +/-20% 10V 0402)
U3  FM25V02A-DGTR  [SON95P400X75_HS-9N]

### Ports
SPI2 (harness SPI2)

### Harnesses
SPI2: SPI2_CLK, SPI2_CS_FRAM#, SPI2_CS_LPS25#, SPI2_MISO, SPI2_MOSI

### Nets
GND: C9.1 U3.4(VSS)
VCC3: C9.2 U3.3(~{WP}) U3.7(~{HOLD}) U3.8(VDD)
SPI2_CLK: U3.6(SCK) ; port SPI2.SPI2_CLK
SPI2_CS_FRAM#: U3.1(~{CS}) ; port SPI2.SPI2_CS_FRAM#
SPI2_MISO: U3.2(SO) ; port SPI2.SPI2_MISO
SPI2_MOSI: U3.5(SI) ; port SPI2.SPI2_MOSI

### Notes on the sheet
- (near U3) FRAM
- Title
- Size:
- Date:
- A4
- Number:
- Time:
- Revision:
- Sheet
- of
- File:

### Library data of the parts
C9 = CMP-001-00061-2: as C1 on sheet  2_mb_conn; Case/Package: 0402; Min Operating Temperature: -55°C; Mounting Technology: SMT; Max Operating Temperature: 85°C; Pins: 2; Voltage Rating: 10V
U3 = CMP-019-00034-2: REEL / F-RAM Memory Serial; Speed: 40MHz; Memory Format: FRAM,RAM; Min Operating Temperature: -40°C; Pins: 8; Max Operating Temperature: 85°C; Case/Package: DFN

## Sheet  6_uart_esc_i2c.SchDoc: PWM/UART
size A3; CompanyName: Altium; Organization: Altium Training Team; Address1: Canada/Germany; Address2: UK / USA and Partner; Address3: Adv Training; Address4: (c) Altium; SheetNumber: 6; SheetTotal: 9
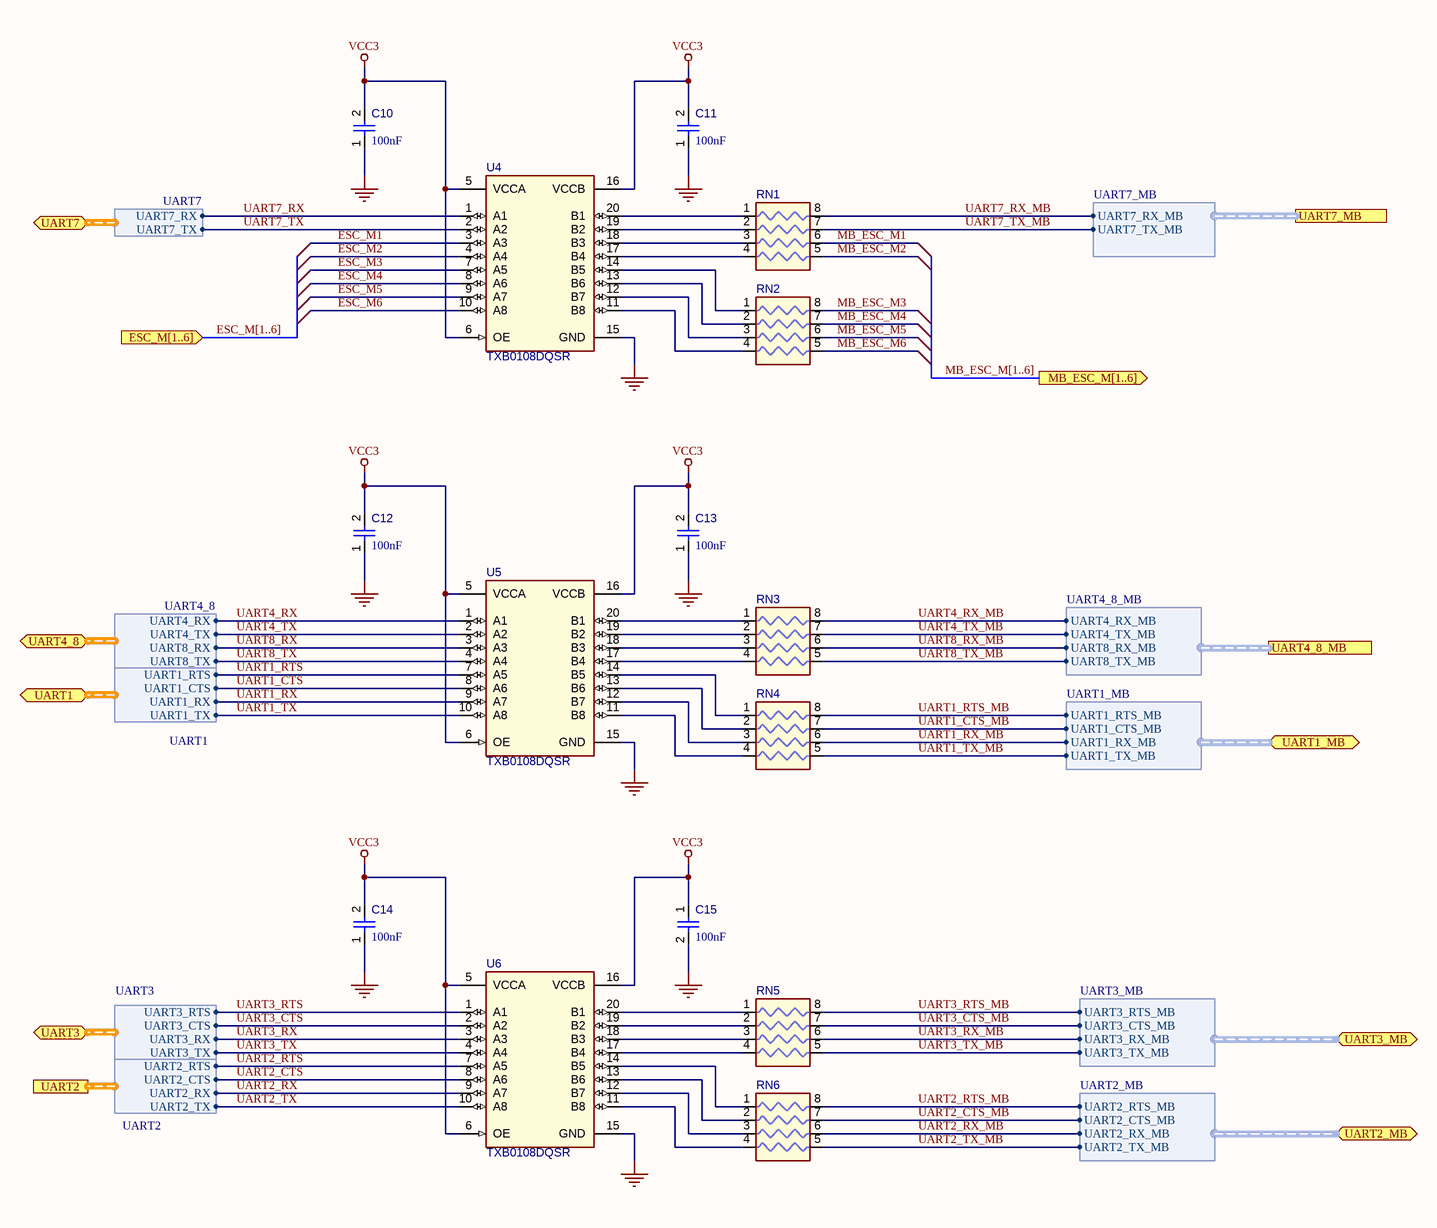
[diagram p6:  6_uart_esc_i2c.SchDoc]

### Parts
C10  value 100nF  [CAPC0402(1005)60_L]  (hidden comment: Capacitor 100nF +/-20% 10V 0402)
C11  value 100nF  [CAPC0402(1005)60_L]  (hidden comment: Capacitor 100nF +/-20% 10V 0402)
C12  value 100nF  [CAPC0402(1005)60_L]  (hidden comment: Capacitor 100nF +/-20% 10V 0402)
C13  value 100nF  [CAPC0402(1005)60_L]  (hidden comment: Capacitor 100nF +/-20% 10V 0402)
C14  value 100nF  [CAPC0402(1005)60_L]  (hidden comment: Capacitor 100nF +/-20% 10V 0402)
C15  value 100nF  [CAPC0402(1005)60_L]  (hidden comment: Capacitor 100nF +/-20% 10V 0402)
RN1  Resistor 200R +/-5% 0402 62.5 mW  [Panasonic_EXB28]  (value not drawn)
RN2  Resistor 200R +/-5% 0402 62.5 mW  [Panasonic_EXB28]  (value not drawn)
RN3  Resistor 200R +/-5% 0402 62.5 mW  [Panasonic_EXB28]  (value not drawn)
RN4  Resistor 200R +/-5% 0402 62.5 mW  [Panasonic_EXB28]  (value not drawn)
RN5  Resistor 200R +/-5% 0402 62.5 mW  [Panasonic_EXB28]  (value not drawn)
RN6  Resistor 200R +/-5% 0402 62.5 mW  [Panasonic_EXB28]  (value not drawn)
U4  TXB0108DQSR  [DQS0020A_V]
U5  TXB0108DQSR  [DQS0020A_V]
U6  TXB0108DQSR  [DQS0020A_V]

### Ports
ESC_M[1..6] (in), MB_ESC_M[1..6] (out), UART1 (bidir, harness UART1), UART1_MB (bidir, harness UART1_MB), UART2 (harness UART2), UART2_MB (bidir, harness UART2_MB), UART3 (bidir, harness UART3), UART3_MB (bidir, harness UART3_MB), UART4_8 (bidir, harness UART4_8), UART4_8_MB (harness UART4_8_MB), UART7 (bidir, harness UART7), UART7_MB (harness UART7_MB)

### Harnesses
UART7: UART7_RX, UART7_TX
UART4_8: UART4_RX, UART4_TX, UART8_RX, UART8_TX
UART1: UART1_RTS, UART1_CTS, UART1_RX, UART1_TX
UART3: UART3_RTS, UART3_CTS, UART3_RX, UART3_TX
UART2: UART2_RTS, UART2_CTS, UART2_RX, UART2_TX
UART3_MB: UART3_RTS_MB, UART3_CTS_MB, UART3_RX_MB, UART3_TX_MB
UART2_MB: UART2_RTS_MB, UART2_CTS_MB, UART2_RX_MB, UART2_TX_MB
UART7_MB: UART7_RX_MB, UART7_TX_MB
UART4_8_MB: UART4_RX_MB, UART4_TX_MB, UART8_RX_MB, UART8_TX_MB
UART1_MB: UART1_RTS_MB, UART1_CTS_MB, UART1_RX_MB, UART1_TX_MB

### Nets
GND: C10.1 C11.1 C12.1 C13.1 C14.1 C15.2 U4.15(GND) U5.15(GND) U6.15(GND)
VCC3: C10.2 C11.2 C12.2 C13.2 C14.2 C15.1 U4.5(VCCA) U4.6(OE) U4.16(VCCB) U5.5(VCCA) U5.6(OE) U5.16(VCCB) U6.5(VCCA) U6.6(OE) U6.16(VCCB)
ESC_M1: U4.3(A3)
ESC_M2: U4.4(A4)
ESC_M3: U4.7(A5)
ESC_M4: U4.8(A6)
ESC_M5: U4.9(A7)
ESC_M6: U4.10(A8)
MB_ESC_M1: RN1.6
MB_ESC_M2: RN1.5
MB_ESC_M3: RN2.8
MB_ESC_M4: RN2.7
MB_ESC_M5: RN2.6
MB_ESC_M6: RN2.5
UART1_CTS: U5.8(A6) ; port UART1.UART1_CTS
UART1_CTS_MB: RN4.7 ; port UART1_MB.UART1_CTS_MB
UART1_RTS: U5.7(A5) ; port UART1.UART1_RTS
UART1_RTS_MB: RN4.8 ; port UART1_MB.UART1_RTS_MB
UART1_RX: U5.9(A7) ; port UART1.UART1_RX
UART1_RX_MB: RN4.6 ; port UART1_MB.UART1_RX_MB
UART1_TX: U5.10(A8) ; port UART1.UART1_TX
UART1_TX_MB: RN4.5 ; port UART1_MB.UART1_TX_MB
UART2_CTS: U6.8(A6) ; port UART2.UART2_CTS
UART2_CTS_MB: RN6.7 ; port UART2_MB.UART2_CTS_MB
UART2_RTS: U6.7(A5) ; port UART2.UART2_RTS
UART2_RTS_MB: RN6.8 ; port UART2_MB.UART2_RTS_MB
UART2_RX: U6.9(A7) ; port UART2.UART2_RX
UART2_RX_MB: RN6.6 ; port UART2_MB.UART2_RX_MB
UART2_TX: U6.10(A8) ; port UART2.UART2_TX
UART2_TX_MB: RN6.5 ; port UART2_MB.UART2_TX_MB
UART3_CTS: U6.2(A2) ; port UART3.UART3_CTS
UART3_CTS_MB: RN5.7 ; port UART3_MB.UART3_CTS_MB
UART3_RTS: U6.1(A1) ; port UART3.UART3_RTS
UART3_RTS_MB: RN5.8 ; port UART3_MB.UART3_RTS_MB
UART3_RX: U6.3(A3) ; port UART3.UART3_RX
UART3_RX_MB: RN5.6 ; port UART3_MB.UART3_RX_MB
UART3_TX: U6.4(A4) ; port UART3.UART3_TX
UART3_TX_MB: RN5.5 ; port UART3_MB.UART3_TX_MB
UART4_RX: U5.1(A1) ; port UART4_8.UART4_RX
UART4_RX_MB: RN3.8 ; port UART4_8_MB.UART4_RX_MB
UART4_TX: U5.2(A2) ; port UART4_8.UART4_TX
UART4_TX_MB: RN3.7 ; port UART4_8_MB.UART4_TX_MB
UART7_RX: U4.1(A1) ; port UART7.UART7_RX
UART7_RX_MB: RN1.8 ; port UART7_MB.UART7_RX_MB
UART7_TX: U4.2(A2) ; port UART7.UART7_TX
UART7_TX_MB: RN1.7 ; port UART7_MB.UART7_TX_MB
UART8_RX: U5.3(A3) ; port UART4_8.UART8_RX
UART8_RX_MB: RN3.6 ; port UART4_8_MB.UART8_RX_MB
UART8_TX: U5.4(A4) ; port UART4_8.UART8_TX
UART8_TX_MB: RN3.5 ; port UART4_8_MB.UART8_TX_MB
NetRN1_1: RN1.1 U4.20(B1)
NetRN1_2: RN1.2 U4.19(B2)
NetRN1_3: RN1.3 U4.18(B3)
NetRN1_4: RN1.4 U4.17(B4)
NetRN2_1: RN2.1 U4.14(B5)
NetRN2_2: RN2.2 U4.13(B6)
NetRN2_3: RN2.3 U4.12(B7)
NetRN2_4: RN2.4 U4.11(B8)
NetRN3_1: RN3.1 U5.20(B1)
NetRN3_2: RN3.2 U5.19(B2)
NetRN3_3: RN3.3 U5.18(B3)
NetRN3_4: RN3.4 U5.17(B4)
NetRN4_1: RN4.1 U5.14(B5)
NetRN4_2: RN4.2 U5.13(B6)
NetRN4_3: RN4.3 U5.12(B7)
NetRN4_4: RN4.4 U5.11(B8)
NetRN5_1: RN5.1 U6.20(B1)
NetRN5_2: RN5.2 U6.19(B2)
NetRN5_3: RN5.3 U6.18(B3)
NetRN5_4: RN5.4 U6.17(B4)
NetRN6_1: RN6.1 U6.14(B5)
NetRN6_2: RN6.2 U6.13(B6)
NetRN6_3: RN6.3 U6.12(B7)
NetRN6_4: RN6.4 U6.11(B8)

### Buses and harness runs
bus ESC_M[1..6] = port ESC_M[1..6]
bus MB_ESC_M[1..6] = port MB_ESC_M[1..6]

### Notes on the sheet
- Title
- Size:
- Date:
- A3
- Number:
- Time:
- Revision:
- Sheet
- of
- File:

### Library data of the parts
C10-C15 = CMP-001-00061-2: as C1 on sheet  2_mb_conn; Case/Package: 0402; Min Operating Temperature: -55°C; Mounting Technology: SMT; Max Operating Temperature: 85°C; Pins: 2; Voltage Rating: 10V
RN1-RN6 = CMP-009-00117-2: Res Thick Film Array 200 Ohm 5% 200ppm/C ISOL Molded 8-Pin 0804(4 X 0402) Convex SMD Punched Carrier T/R; Value: 200; Power: 62.5mW; Case/Package: 0402; Min Operating Temperature: -55°C; Tolerance: 5%; Max Operating Temperature: 125°C; Pins: 8
U4-U6 = CMP-015-00004-2: Bidirectional Voltage-Level Translator with Auto-Direction Sensing and +/-15 KV ESD Protection, 8 Bit, -40 to 85 degC, 20-Pin USON (DQS), Green (RoHS & no Sb/Br), Tape and Reel; Pins: 20

## Sheet  7_can_rc_i2c_analog.SchDoc: CAN/RCIN/I2C/Analog inputs
size A3; CompanyName: Altium; Organization: Altium Training Team; Address1: Canada/Germany; Address2: UK / USA and Partner; Address3: Adv Training; Address4: (c) Altium; SheetNumber: 7; SheetTotal: 9
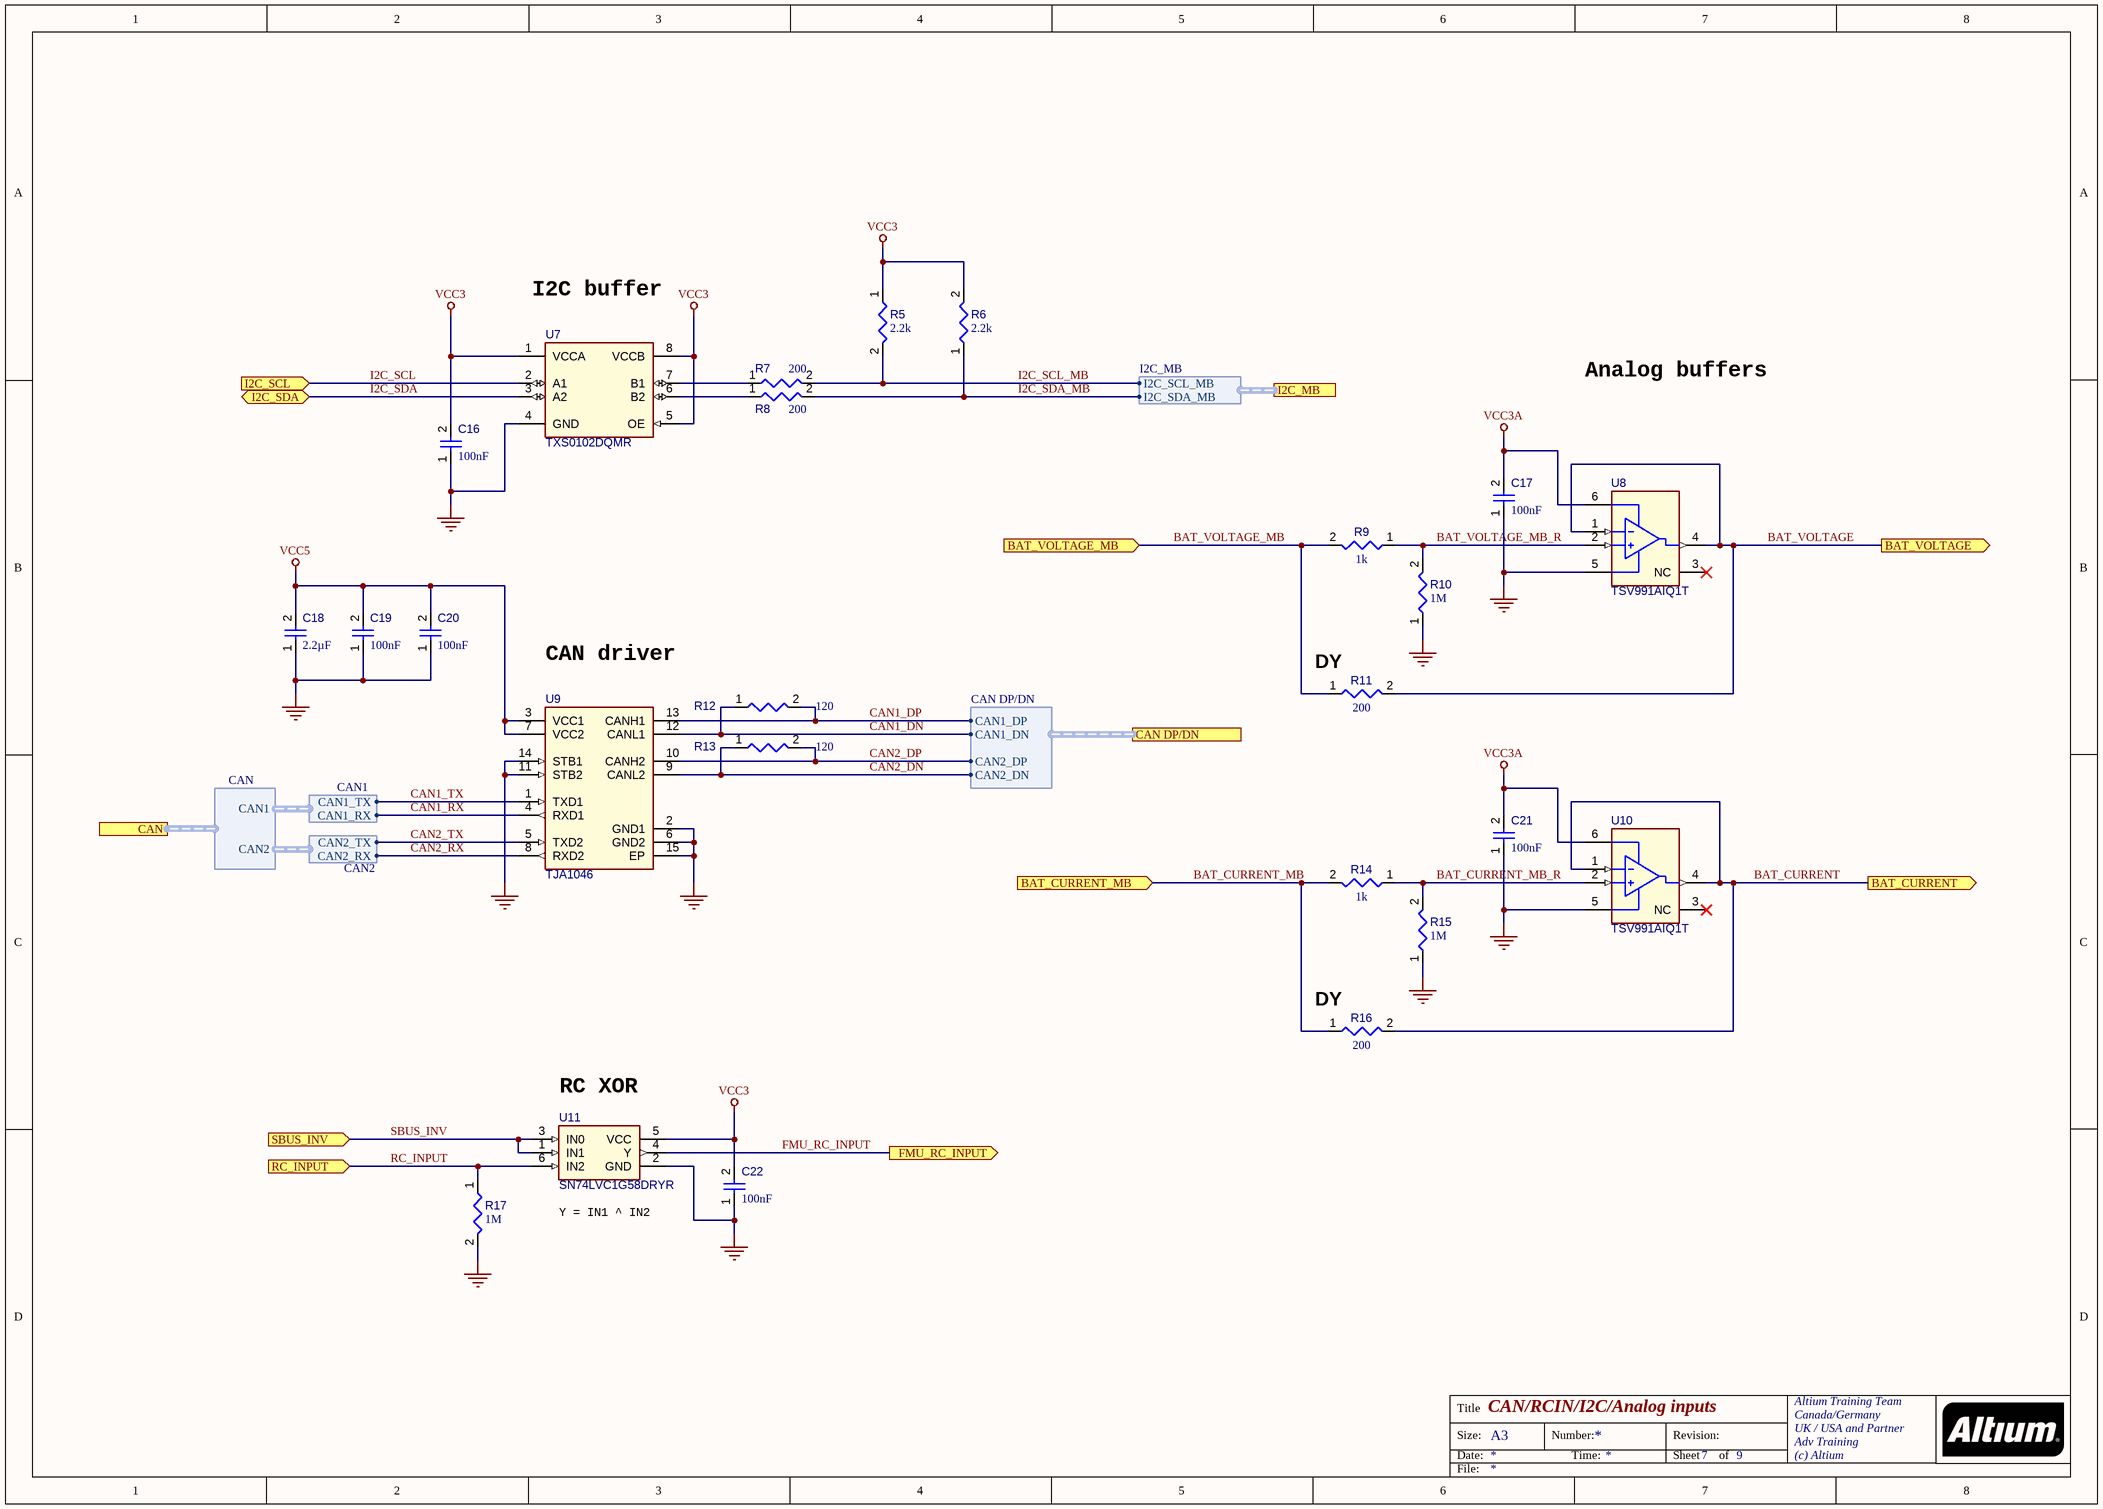
[diagram p7:  7_can_rc_i2c_analog.SchDoc]

### Parts
C16  value 100nF  [CAPC0402(1005)60_L]  (hidden comment: Capacitor 100nF +/-20% 10V 0402)
C17  value 100nF  [CAPC0402(1005)60_L]  (hidden comment: Capacitor 100nF +/-20% 10V 0402)
C18  value 2.2µF  [CAPC0402(1005)60_L]  (hidden comment: Capacitor 2,2µF +/-20% 10V 0402)
C19  value 100nF  [CAPC0402(1005)60_L]  (hidden comment: Capacitor 100nF +/-20% 10V 0402)
C20  value 100nF  [CAPC0402(1005)60_L]  (hidden comment: Capacitor 100nF +/-20% 10V 0402)
C21  value 100nF  [CAPC0402(1005)60_L]  (hidden comment: Capacitor 100nF +/-20% 10V 0402)
C22  value 100nF  [CAPC0402(1005)60_L]  (hidden comment: Capacitor 100nF +/-20% 10V 0402)
R5  value 2.2k  [RESC0402(1005)_L]  (hidden comment: Resistor 2K2  +/-5 % 0402 63 mW)
R6  value 2.2k  [RESC0402(1005)_L]  (hidden comment: Resistor 2K2  +/-5 % 0402 63 mW)
R7  value 200  [RESC0402(1005)_L]  (hidden comment: Resistor 200R +/-5 % 0402 63 mW)
R8  value 200  [RESC0402(1005)_L]  (hidden comment: Resistor 200R +/-5 % 0402 63 mW)
R9  value 1k  [RESC0402(1005)_L]  (hidden comment: Resistor 1K +/-5 % 0402 63 mW)
R10  value 1M  [RESC0402(1005)_L]  (hidden comment: Resistor 1M +/-5 % 0402 63 mW)
R11  value 200  [RESC0402(1005)_L]  (hidden comment: Resistor 200R +/-5 % 0402 63 mW)
R12  value 120  [RESC0603(1608)_L]  (hidden comment: Resistor 120R +/-5 % 0603 0.1 W)
R13  value 120  [RESC0603(1608)_L]  (hidden comment: Resistor 120R +/-5 % 0603 0.1 W)
R14  value 1k  [RESC0402(1005)_L]  (hidden comment: Resistor 1K +/-5 % 0402 63 mW)
R15  value 1M  [RESC0402(1005)_L]  (hidden comment: Resistor 1M +/-5 % 0402 63 mW)
R16  value 200  [RESC0402(1005)_L]  (hidden comment: Resistor 200R +/-5 % 0402 63 mW)
R17  value 1M  [RESC0402(1005)_L]  (hidden comment: Resistor 1M +/-5 % 0402 63 mW)
U7  TXS0102DQMR  [DQM]
U8  TSV991AIQ1T  [STM-DFN-8_V]
U9  TJA1046  [NXP-SOT1086-2_L]
U10  TSV991AIQ1T  [STM-DFN-8_V]
U11  SN74LVC1G58DRYR  [DRY0006A_V]

### Ports
BAT_CURRENT (out), BAT_CURRENT_MB (in), BAT_VOLTAGE (out), BAT_VOLTAGE_MB (in), CAN (harness CAN), CAN DP/DN (harness CAN DP/DN), FMU_RC_INPUT (out), I2C_MB (harness I2C_MB), I2C_SCL (in), I2C_SDA (bidir), RC_INPUT (in), SBUS_INV (in)

### Harnesses
CAN DP/DN: CAN1_DP, CAN1_DN, CAN2_DP, CAN2_DN
I2C_MB: I2C_SCL_MB, I2C_SDA_MB
CAN1: CAN1_RX, CAN1_TX
CAN2: CAN2_TX, CAN2_RX
CAN: CAN1, CAN2

### Nets
GND: C16.1 C17.1 C18.1 C19.1 C20.1 C21.1 C22.1 R10.1 R15.1 R17.2 U7.4(GND) U8.5(VCC-) U9.2(GND1) U9.6(GND2) U9.11(STB2) U9.14(STB1) U9.15(EP) U10.5(VCC-) U11.2(GND)
VCC3: C16.2 C22.2 R5.1 R6.2 U7.1(VCCA) U7.5(OE) U7.8(VCCB) U11.5(VCC)
VCC3A: C17.2 C21.2 U8.6(VCC+) U10.6(VCC+)
VCC5: C18.2 C19.2 C20.2 U9.3(VCC1) U9.7(VCC2)
BAT_CURRENT: R16.2 U10.1(IN-) U10.4(OUT) ; port BAT_CURRENT
BAT_CURRENT_MB: R14.2 R16.1 ; port BAT_CURRENT_MB
BAT_CURRENT_MB_R: R14.1 R15.2 U10.2(IN+)
BAT_VOLTAGE: R11.2 U8.1(IN-) U8.4(OUT) ; port BAT_VOLTAGE
BAT_VOLTAGE_MB: R9.2 R11.1 ; port BAT_VOLTAGE_MB
BAT_VOLTAGE_MB_R: R9.1 R10.2 U8.2(IN+)
CAN1_DN: R12.1 U9.12(CANL1) ; port CAN DP/DN.CAN1_DN
CAN1_DP: R12.2 U9.13(CANH1) ; port CAN DP/DN.CAN1_DP
CAN1_RX: U9.4(RXD1) ; harness CAN1.CAN1_RX
CAN1_TX: U9.1(TXD1) ; harness CAN1.CAN1_TX
CAN2_DN: R13.1 U9.9(CANL2) ; port CAN DP/DN.CAN2_DN
CAN2_DP: R13.2 U9.10(CANH2) ; port CAN DP/DN.CAN2_DP
CAN2_RX: U9.8(RXD2) ; harness CAN2.CAN2_RX
CAN2_TX: U9.5(TXD2) ; harness CAN2.CAN2_TX
FMU_RC_INPUT: U11.4(Y) ; port FMU_RC_INPUT
I2C_SCL: U7.2(A1) ; port I2C_SCL
I2C_SCL_MB: R5.2 R7.2 ; port I2C_MB.I2C_SCL_MB
I2C_SDA: U7.3(A2) ; port I2C_SDA
I2C_SDA_MB: R6.1 R8.2 ; port I2C_MB.I2C_SDA_MB
RC_INPUT: R17.1 U11.6(IN2) ; port RC_INPUT
SBUS_INV: U11.1(IN1) U11.3(IN0) ; port SBUS_INV
NetR7_1: R7.1 U7.7(B1)
NetR8_1: R8.1 U7.6(B2)

Not connected (* = marked no-connect by the designer): U8 3(NC)*; U10 3(NC)*

### Notes on the sheet
- I2C buffer
- Analog buffers
- CAN driver
- (near R11) DY
- (near R16) DY
- (near U11) RC XOR
- (near U11) Y = IN1 ^ IN2
- Title
- Size:
- Date:
- A3
- Number:
- Time:
- Revision:
- Sheet
- of
- File:

### Library data of the parts
C16 C17 C19-C22 = CMP-001-00061-2: as C1 on sheet  2_mb_conn; Case/Package: 0402; Min Operating Temperature: -55°C; Mounting Technology: SMT; Max Operating Temperature: 85°C; Pins: 2; Voltage Rating: 10V
C18 = CMP-001-00056-3: as C28 on sheet  4_cpu; Case/Package: 0402; Voltage Rating: 10V; Mounting Technology: SMT; Min Operating Temperature: -55°C; Max Operating Temperature: 85°C; Pins: 2
R5 R6 = CMP-009-00166-2: Chip Resistor, 2,2 kOhms, +/-5 %, 63 mW, -55 to 155 degC, 0402; Power: 63mW; Tolerance: 5%; Case/Package: 0402; Max Operating Temperature: 155°C; Min Operating Temperature: -55°C; Pins: 2
R7 R8 R11 R16 = CMP-009-00161-2: Chip Resistor, 200 Ohms, +/-5 %, 63 mW, -55 to 155 degC, 0402; Power: 63mW; Tolerance: 5%; Case/Package: 0402; Max Operating Temperature: 155°C; Min Operating Temperature: -55°C; Pins: 2
R9 R14 = CMP-009-00157-2: as R3 on sheet  3_power; Case/Package: 0402; Max Operating Temperature: 155°C; Min Operating Temperature: -55°C; Pins: 2
R10 R15 R17 = CMP-009-00151-2: as R27 on sheet  4_cpu; Case/Package: 0402; Max Operating Temperature: 155°C; Min Operating Temperature: -55°C; Pins: 2
R12 R13 = CMP-009-00176-2: Chip Resistor, 120 Ohms, +/-5 %, 0.1 W, -55 to 155 degC, 0603; Tolerance: 5%; Power: 100mW; Case/Package: 0603; Max Operating Temperature: 155°C; Min Operating Temperature: -55°C; Pins: 2
U7 = CMP-015-00002-2: IC TRANSLATOR VOLTAGE 8-X2SON; Max Supply Voltage: 5.5V; Min Supply Voltage: 1.65V; Max Operating Temperature: 85°C; Min Operating Temperature: -40°C; Pins: 8
U8 U10 = CMP-014-00000-2: Rail-to-rail Input / Output GBP Operational Amplifier, 20 MHz, -40 to 125 degC, 6-Pin DFN, RoHS, Tape and Reel; Channels: 2; Min Operating Temperature: -40°C; Max Operating Temperature: 125°C; Pins: 6
U9 = CMP-015-00005-3: Dual High-speed CAN Transceiver with Standby Mode, 4.75 to 5.25 V, 14-Pin HVSON, RoHS, Tape and Reel; Pins: 15
U11 = CMP-031-00001-1: CONFIGURABLE MULTIPLE-FUNCTION GATE, DRY0006A, LARGE T&R; Pins: 6

## Sheet  8_imu_debug_conn.SchDoc: IMU/DEBUG connectors
size A4; CompanyName: Altium; Organization: Altium Training Team; Address1: Canada/Germany; Address2: UK / USA and Partner; Address3: Adv Training; Address4: (c) Altium; SheetNumber: 8; SheetTotal: 9
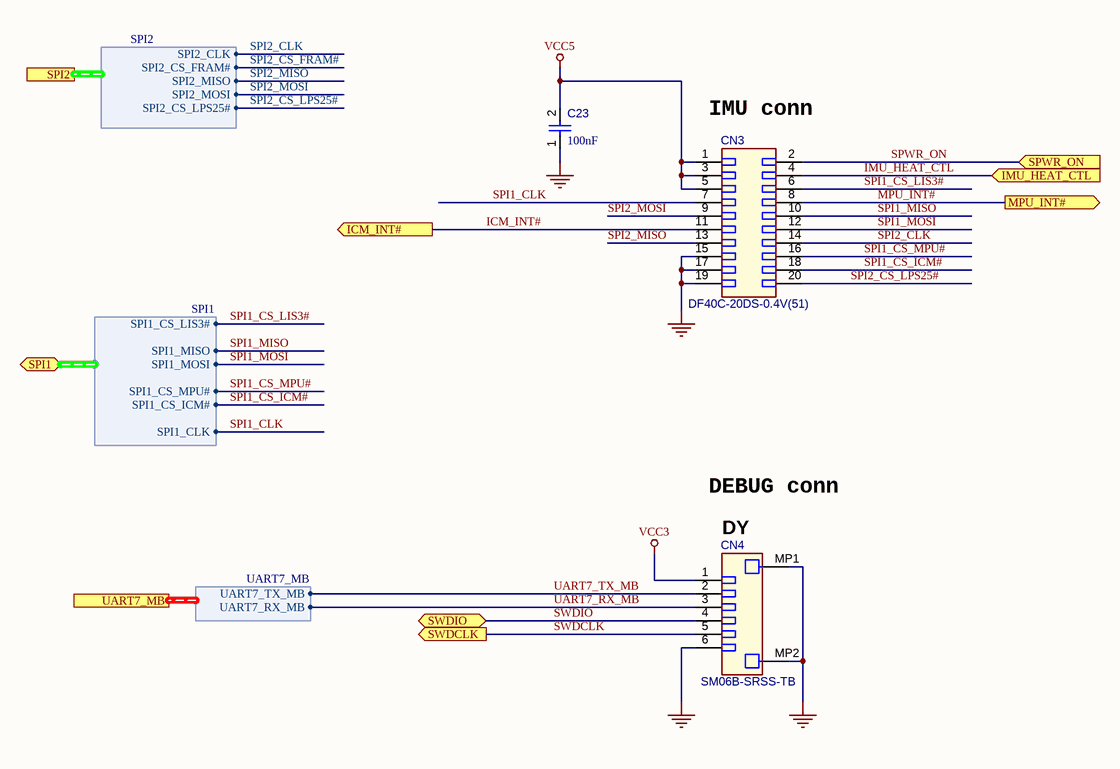
[diagram p8:  8_imu_debug_conn.SchDoc]

### Parts
C23  value 100nF  [CAPC0402(1005)60_L]  (hidden comment: Capacitor 100nF +/-20% 10V 0402)
CN3  DF40C-20DS-0.4V(51)  [HIRO-DF40C-20DS-0.4V(51)_V]
CN4  SM06B-SRSS-TB  [JST-SM06B-SRSS-TB_V]

### Ports
ICM_INT# (out), IMU_HEAT_CTL (in), MPU_INT# (out), SPI1 (bidir, harness SPI1), SPI2 (harness SPI2), SPWR_ON (in), SWDCLK (out), SWDIO (bidir), UART7_MB (harness UART7_MB)

### Harnesses
SPI2: SPI2_CLK, SPI2_CS_FRAM#, SPI2_MISO, SPI2_MOSI, SPI2_CS_LPS25#
UART7_MB: UART7_RX_MB, UART7_TX_MB
SPI1: SPI1_MISO, SPI1_MOSI, SPI1_CS_LIS3#, SPI1_CS_MPU#, SPI1_CS_ICM#, SPI1_CLK

### Nets
GND: C23.1 CN3.15 CN3.17 CN3.19 CN4.6 CN4.MP1 CN4.MP2
VCC3: CN4.1
VCC5: C23.2 CN3.1 CN3.3 CN3.5
ICM_INT#: CN3.11 ; port ICM_INT#
IMU_HEAT_CTL: CN3.4 ; port IMU_HEAT_CTL
MPU_INT#: CN3.8 ; port MPU_INT#
SPI1_CLK: CN3.7 ; port SPI1.SPI1_CLK
SPI1_CS_ICM#: CN3.18 ; port SPI1.SPI1_CS_ICM#
SPI1_CS_LIS3#: CN3.6 ; port SPI1.SPI1_CS_LIS3#
SPI1_CS_MPU#: CN3.16 ; port SPI1.SPI1_CS_MPU#
SPI1_MISO: CN3.10 ; port SPI1.SPI1_MISO
SPI1_MOSI: CN3.12 ; port SPI1.SPI1_MOSI
SPI2_CLK: CN3.14 ; port SPI2.SPI2_CLK
SPI2_CS_FRAM#: port SPI2.SPI2_CS_FRAM#
SPI2_CS_LPS25#: CN3.20 ; port SPI2.SPI2_CS_LPS25#
SPI2_MISO: CN3.13 ; port SPI2.SPI2_MISO
SPI2_MOSI: CN3.9 ; port SPI2.SPI2_MOSI
SPWR_ON: CN3.2 ; port SPWR_ON
SWDCLK: CN4.5 ; port SWDCLK
SWDIO: CN4.4 ; port SWDIO
UART7_RX_MB: CN4.3 ; port UART7_MB.UART7_RX_MB
UART7_TX_MB: CN4.2 ; port UART7_MB.UART7_TX_MB

### Notes on the sheet
- (near CN3) IMU conn
- DEBUG conn
- (near CN4) DY
- Title
- Size:
- Date:
- A4
- Number:
- Time:
- Revision:
- Sheet
- of
- File:

### Library data of the parts
C23 = CMP-001-00061-2: as C1 on sheet  2_mb_conn; Min Operating Temperature: -55°C; Case/Package: 0402; Voltage Rating: 10V; Pins: 2; Mounting Technology: SMT; Max Operating Temperature: 85°C
CN3 = CMP-002-00059-2: Receptacle Connector, 30 V, 0.3 A, -35 to 85 degC, RoHS, Tape and Reel; Connector Type: Receptacle,CenterStripContacts; Pins: 20
CN4 = CMP-002-00060-2: Male Header, Pitch 1 mm, 1 x 6 Position, Height 2.95 mm, -25 to 85 degC, RoHS, Tape and Reel; Mounting Technology: SurfaceMount; Pins: 8; Case/Package: Male Header, Pitch 1 mm, 1 X 6 Position, Height 2.9 mm

## Sheet  0_TOP_Sheet.SchDoc: TOP Sheet Kame FMU
size A3; CompanyName: Altium; Organization: Altium Training Team; Address1: Canada/Germany; Address2: UK / USA and Partner; Address3: Adv Training; Address4: (c) Altium; Revision: 2; SheetNumber: 0; SheetTotal: 9
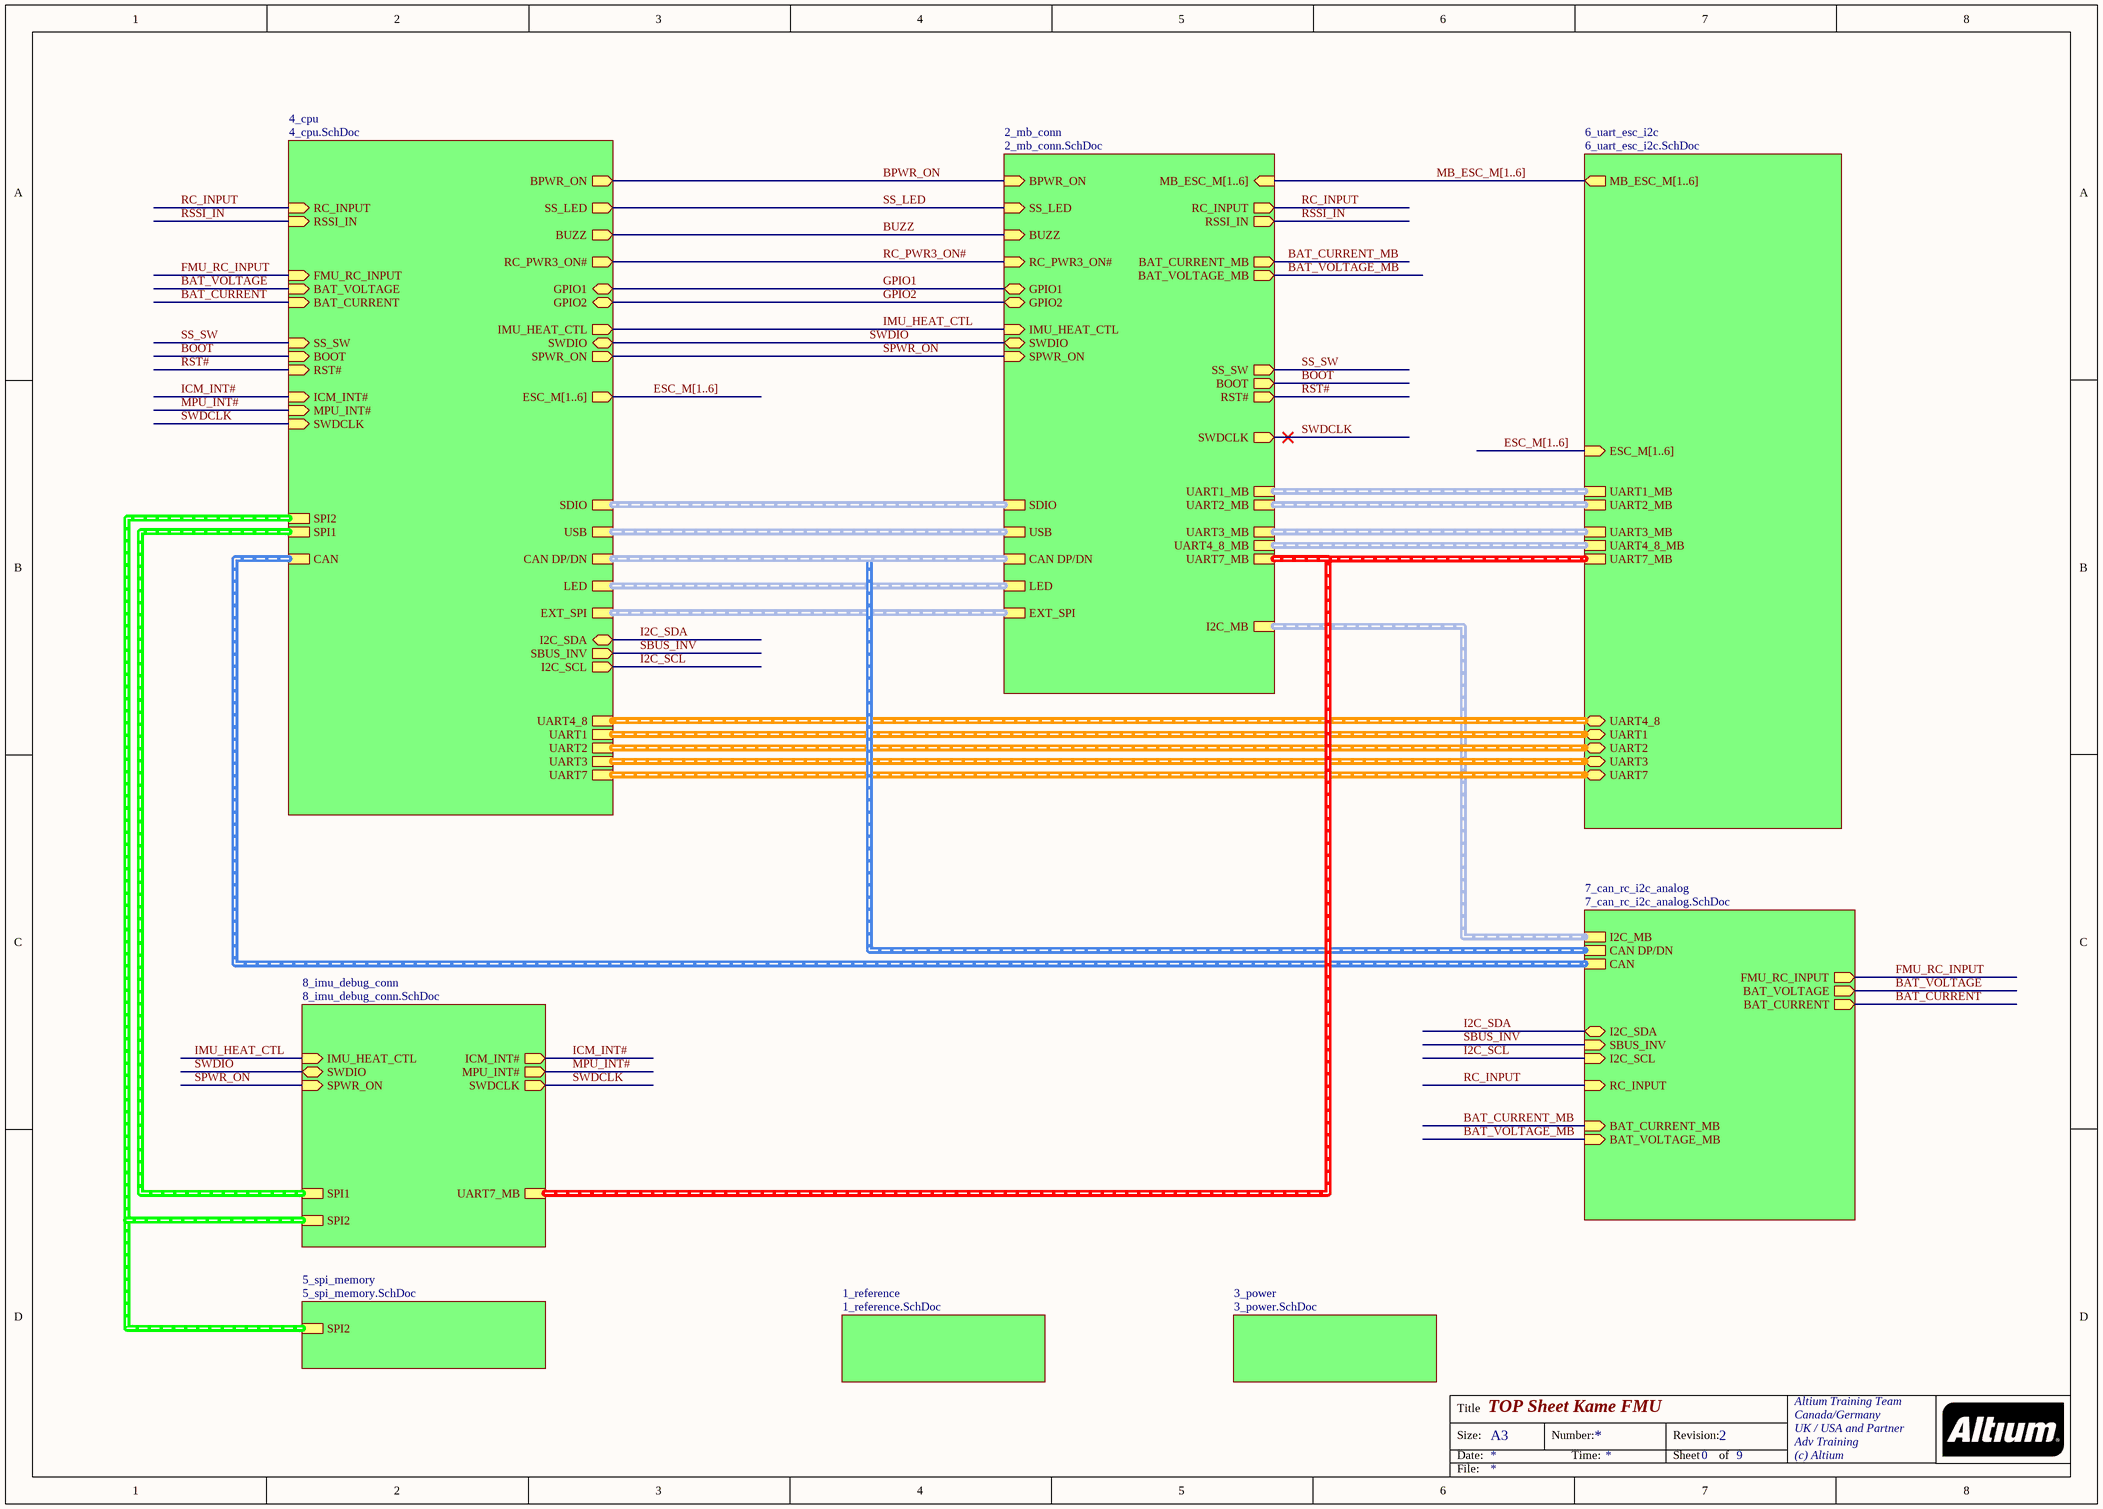
[diagram p9:  0_TOP_Sheet.SchDoc]

### Sub-sheets
1_reference = 1_reference.SchDoc (file not in this document): no entries
2_mb_conn = 2_mb_conn.SchDoc (file not in this document): BPWR_ON (in), SPWR_ON (in), RC_INPUT (out), RSSI_IN (out), BUZZ (in), BOOT (out), RST# (out), SWDIO (bidir), SWDCLK (out), SS_LED (in), BAT_CURRENT_MB (out), BAT_VOLTAGE_MB (out), RC_PWR3_ON# (in), IMU_HEAT_CTL (in), GPIO1 (bidir), GPIO2 (bidir), SS_SW (out), MB_ESC_M[1..6] (in), SDIO (harness SDIO), UART3_MB (harness UART3_MB), EXT_SPI (harness EXT_SPI), I2C_MB (harness I2C_MB), UART2_MB (harness UART2_MB), CAN DP/DN (harness CAN DP/DN), USB (harness USB), LED (harness LED), UART7_MB (harness UART7_MB), UART1_MB (harness UART1_MB), UART4_8_MB (harness UART4_8_MB)
3_power = 3_power.SchDoc (file not in this document): no entries
4_cpu = 4_cpu.SchDoc (file not in this document): RC_INPUT (in), I2C_SCL (out), I2C_SDA (bidir), BAT_VOLTAGE (in), BAT_CURRENT (in), SS_LED (out), FMU_RC_INPUT (in), SBUS_INV (out), RC_PWR3_ON# (out), GPIO2 (bidir), GPIO1 (bidir), SS_SW (in), IMU_HEAT_CTL (out), SWDIO (bidir), SWDCLK (in), BOOT (in), RST# (in), BPWR_ON (out), SPWR_ON (out), BUZZ (out), ICM_INT# (in), MPU_INT# (in), RSSI_IN (in), ESC_M[1..6] (out), LED (harness LED), SDIO (harness SDIO), CAN DP/DN (harness CAN DP/DN), USB (harness USB), SPI2 (harness SPI2), EXT_SPI (harness EXT_SPI), UART4_8 (harness UART4_8), UART1 (harness UART1), UART2 (harness UART2), UART3 (harness UART3), UART7 (harness UART7), SPI1 (harness SPI1), CAN (harness CAN)
5_spi_memory = 5_spi_memory.SchDoc (file not in this document): SPI2 (harness SPI2)
6_uart_esc_i2c = 6_uart_esc_i2c.SchDoc (file not in this document): MB_ESC_M[1..6] (out), ESC_M[1..6] (in), UART2 (bidir, harness UART2), UART3 (bidir, harness UART3), UART1 (bidir, harness UART1), UART4_8 (bidir, harness UART4_8), UART7 (bidir, harness UART7), UART3_MB (harness UART3_MB), UART2_MB (harness UART2_MB), UART7_MB (harness UART7_MB), UART4_8_MB (harness UART4_8_MB), UART1_MB (harness UART1_MB)
7_can_rc_i2c_analog = 7_can_rc_i2c_analog.SchDoc (file not in this document): FMU_RC_INPUT (out), BAT_VOLTAGE (out), BAT_CURRENT (out), SBUS_INV (in), RC_INPUT (in), BAT_CURRENT_MB (in), BAT_VOLTAGE_MB (in), I2C_SCL (in), I2C_SDA (bidir), CAN DP/DN (harness CAN DP/DN), I2C_MB (harness I2C_MB), CAN (harness CAN)
8_imu_debug_conn = 8_imu_debug_conn.SchDoc (file not in this document): ICM_INT# (out), MPU_INT# (out), IMU_HEAT_CTL (in), SWDCLK (out), SWDIO (bidir), SPWR_ON (in), SPI2 (harness SPI2), UART7_MB (harness UART7_MB), SPI1 (harness SPI1)

### Nets
BAT_CURRENT: sheet 4_cpu/BAT_CURRENT, sheet 7_can_rc_i2c_analog/BAT_CURRENT
BAT_CURRENT_MB: sheet 2_mb_conn/BAT_CURRENT_MB, sheet 7_can_rc_i2c_analog/BAT_CURRENT_MB
BAT_VOLTAGE: sheet 4_cpu/BAT_VOLTAGE, sheet 7_can_rc_i2c_analog/BAT_VOLTAGE
BAT_VOLTAGE_MB: sheet 2_mb_conn/BAT_VOLTAGE_MB, sheet 7_can_rc_i2c_analog/BAT_VOLTAGE_MB
BOOT: sheet 2_mb_conn/BOOT, sheet 4_cpu/BOOT
BPWR_ON: sheet 2_mb_conn/BPWR_ON, sheet 4_cpu/BPWR_ON
BUZZ: sheet 2_mb_conn/BUZZ, sheet 4_cpu/BUZZ
FMU_RC_INPUT: sheet 4_cpu/FMU_RC_INPUT, sheet 7_can_rc_i2c_analog/FMU_RC_INPUT
GPIO1: sheet 2_mb_conn/GPIO1, sheet 4_cpu/GPIO1
GPIO2: sheet 2_mb_conn/GPIO2, sheet 4_cpu/GPIO2
I2C_SCL: sheet 4_cpu/I2C_SCL, sheet 7_can_rc_i2c_analog/I2C_SCL
I2C_SDA: sheet 4_cpu/I2C_SDA, sheet 7_can_rc_i2c_analog/I2C_SDA
ICM_INT#: sheet 4_cpu/ICM_INT#, sheet 8_imu_debug_conn/ICM_INT#
IMU_HEAT_CTL: sheet 2_mb_conn/IMU_HEAT_CTL, sheet 4_cpu/IMU_HEAT_CTL, sheet 8_imu_debug_conn/IMU_HEAT_CTL
MPU_INT#: sheet 4_cpu/MPU_INT#, sheet 8_imu_debug_conn/MPU_INT#
RC_INPUT: sheet 2_mb_conn/RC_INPUT, sheet 4_cpu/RC_INPUT, sheet 7_can_rc_i2c_analog/RC_INPUT
RC_PWR3_ON#: sheet 2_mb_conn/RC_PWR3_ON#, sheet 4_cpu/RC_PWR3_ON#
RSSI_IN: sheet 2_mb_conn/RSSI_IN, sheet 4_cpu/RSSI_IN
RST#: sheet 2_mb_conn/RST#, sheet 4_cpu/RST#
SBUS_INV: sheet 4_cpu/SBUS_INV, sheet 7_can_rc_i2c_analog/SBUS_INV
SPWR_ON: sheet 2_mb_conn/SPWR_ON, sheet 4_cpu/SPWR_ON, sheet 8_imu_debug_conn/SPWR_ON
SS_LED: sheet 2_mb_conn/SS_LED, sheet 4_cpu/SS_LED
SS_SW: sheet 2_mb_conn/SS_SW, sheet 4_cpu/SS_SW
SWDCLK: sheet 2_mb_conn/SWDCLK, sheet 4_cpu/SWDCLK, sheet 8_imu_debug_conn/SWDCLK
SWDIO: sheet 2_mb_conn/SWDIO, sheet 4_cpu/SWDIO, sheet 8_imu_debug_conn/SWDIO

### Buses and harness runs
bus ESC_M[1..6] = sheet 4_cpu/ESC_M[1..6]
bus ESC_M[1..6] = sheet 6_uart_esc_i2c/ESC_M[1..6]
bus MB_ESC_M[1..6] = sheet 2_mb_conn/MB_ESC_M[1..6] = sheet 6_uart_esc_i2c/MB_ESC_M[1..6]
harness sheet 2_mb_conn/CAN DP/DN = sheet 4_cpu/CAN DP/DN = sheet 7_can_rc_i2c_analog/CAN DP/DN
harness sheet 2_mb_conn/EXT_SPI = sheet 4_cpu/EXT_SPI
harness sheet 2_mb_conn/I2C_MB = sheet 7_can_rc_i2c_analog/I2C_MB
harness sheet 2_mb_conn/LED = sheet 4_cpu/LED
harness sheet 2_mb_conn/SDIO = sheet 4_cpu/SDIO
harness sheet 2_mb_conn/UART1_MB = sheet 6_uart_esc_i2c/UART1_MB
harness sheet 2_mb_conn/UART2_MB = sheet 6_uart_esc_i2c/UART2_MB
harness sheet 2_mb_conn/UART3_MB = sheet 6_uart_esc_i2c/UART3_MB
harness sheet 2_mb_conn/UART4_8_MB = sheet 6_uart_esc_i2c/UART4_8_MB
harness sheet 2_mb_conn/UART7_MB = sheet 6_uart_esc_i2c/UART7_MB = sheet 8_imu_debug_conn/UART7_MB
harness sheet 2_mb_conn/USB = sheet 4_cpu/USB
harness sheet 4_cpu/CAN = sheet 7_can_rc_i2c_analog/CAN
harness sheet 4_cpu/SPI1 = sheet 8_imu_debug_conn/SPI1
harness sheet 4_cpu/SPI2 = sheet 5_spi_memory/SPI2 = sheet 8_imu_debug_conn/SPI2
harness sheet 4_cpu/UART1 = sheet 6_uart_esc_i2c/UART1
harness sheet 4_cpu/UART2 = sheet 6_uart_esc_i2c/UART2
harness sheet 4_cpu/UART3 = sheet 6_uart_esc_i2c/UART3
harness sheet 4_cpu/UART4_8 = sheet 6_uart_esc_i2c/UART4_8
harness sheet 4_cpu/UART7 = sheet 6_uart_esc_i2c/UART7

### Notes on the sheet
- Title
- Size:
- Date:
- A3
- Number:
- Time:
- Revision:
- Sheet
- of
- File:

## Nets that join several sheets
GND:  2_mb_conn (36 pins),  3_power (11 pins),  4_cpu (34 pins),  5_spi_memory (C9.1 U3.4),  6_uart_esc_i2c (9 pins),  7_can_rc_i2c_analog (19 pins),  8_imu_debug_conn (7 pins)
VCC3:  2_mb_conn (C2.2 CN2.2 CN2.4),  3_power (C5.2 C6.1 L1.2 R2.1),  4_cpu (16 pins),  5_spi_memory (C9.2 U3.3 U3.7 U3.8),  6_uart_esc_i2c (15 pins),  7_can_rc_i2c_analog (8 pins),  8_imu_debug_conn (CN4.1)
VCC3A:  3_power (C8.2 U2.1),  4_cpu (C37.1 C38.2 R20.1 U12.22),  7_can_rc_i2c_analog (C17.2 C21.2 U8.6 U10.6)
VCC5:  2_mb_conn (5 pins),  3_power (9 pins),  4_cpu (R21.2 R23.2),  7_can_rc_i2c_analog (5 pins),  8_imu_debug_conn (C23.2 CN3.1 CN3.3 CN3.5)